# EAGLE design hwsdemu-final (EAGLE 9.0.1)

## Sheet 1 of 3
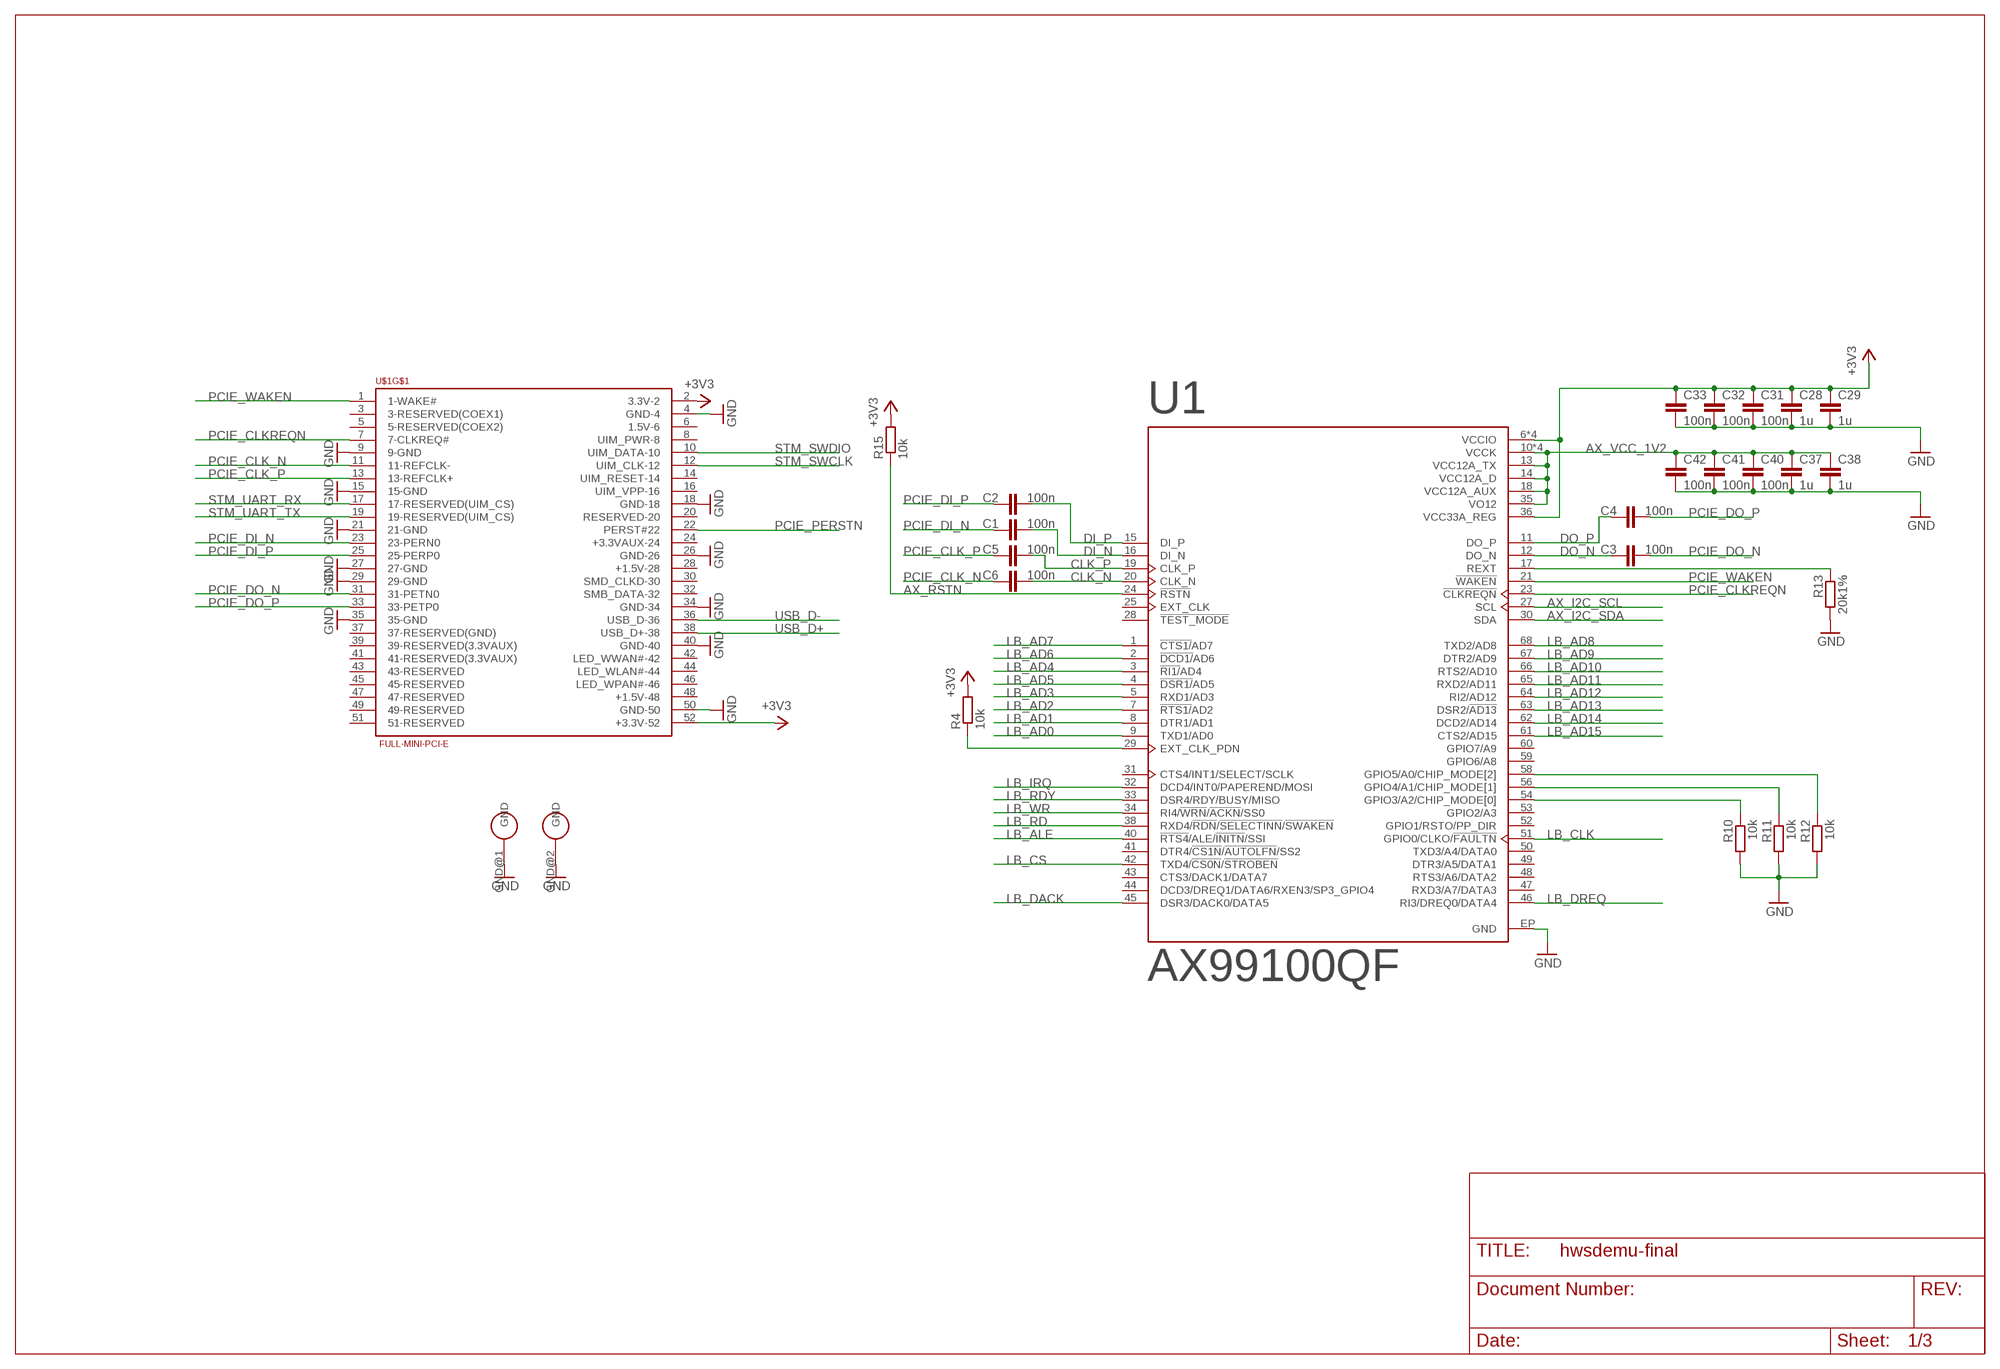
[diagram p0: schematic, sheet 1]

### Parts
C1  100n  C-EUC0402  [C0402]
C2  100n  C-EUC0402  [C0402]
C3  100n  C-EUC0402  [C0402]
C4  100n  C-EUC0402  [C0402]
C5  100n  C-EUC0402  [C0402]
C6  100n  C-EUC0402  [C0402]
C28  1u  C-EUC0402  [C0402]
C29  1u  C-EUC0402  [C0402]
C31  100n  C-EUC0402  [C0402]
C32  100n  C-EUC0402  [C0402]
C33  100n  C-EUC0402  [C0402]
C37  1u  C-EUC0402  [C0402]
C38  1u  C-EUC0402  [C0402]
C40  100n  C-EUC0402  [C0402]
C41  100n  C-EUC0402  [C0402]
C42  100n  C-EUC0402  [C0402]
R4  10k  R-EU_R0402  [R0402]
R10  10k  R-EU_R0402  [R0402]
R11  10k  R-EU_R0402  [R0402]
R12  10k  R-EU_R0402  [R0402]
R13  20k1%  R-EU_R0402  [R0402]
R15  10k  R-EU_R0402  [R0402]
U1  AX99100QF  [QFN40P800X800X90-69N]
U$1  FULL-MINI-PCI-E  [FULL-MINI-PCI-E]

### Nets
+3V3 [supply]: C28.1 C29.1 C31.1 C32.1 C33.1 R4.2 R15.2 U1.6(VCCIO) U1.26(VCCIO) U1.36(VCC33A_REG) U1.39(VCCIO) U1.55(VCCIO) U$1.2(3.3V-2) U$1.52(+3.3V-52) ; also sheet 2,3
AX_I2C_SCL: U1.27(SCL) ; also sheet 3
AX_I2C_SDA: U1.30(SDA) ; also sheet 3
AX_RSTN: R15.1 U1.24(!RSTN) ; also sheet 3
AX_VCC_1V2 [supply]: C37.1 C38.1 C40.1 C41.1 C42.1 U1.10(VCCK) U1.13(VCC12A_TX) U1.14(VCC12A_D) U1.18(VCC12A_AUX) U1.22(VCCK) U1.35(VO12) U1.37(VCCK) U1.57(VCCK)
CLK_N [differential]: C6.2 U1.20(CLK_N)
CLK_P [differential]: C5.2 U1.19(CLK_P)
DI_N [differential]: C1.2 U1.16(DI_N)
DI_P [differential]: C2.2 U1.15(DI_P)
DO_N [differential]: C3.1 U1.12(DO_N)
DO_P [differential]: C4.1 U1.11(DO_P)
GND [supply]: C28.2 C29.2 C31.2 C32.2 C33.2 C37.2 C38.2 C40.2 C41.2 C42.2 R10.2 R11.2 R12.2 R13.2 U1.EP(GND) U$1.4(GND-4) U$1.9(9-GND) U$1.15(15-GND) U$1.18(GND-18) U$1.21(21-GND) U$1.26(GND-26) U$1.27(27-GND) U$1.29(29-GND) U$1.34(GND-34) U$1.35(35-GND) U$1.40(GND-40) U$1.50(GND-50) U$1.GND@1(GND) U$1.GND@2(GND) ; also sheet 2,3
LB_AD0: U1.9(TXD1/AD0) ; also sheet 2
LB_AD1: U1.8(DTR1/AD1) ; also sheet 2
LB_AD2: U1.7(!RTS1/!AD2) ; also sheet 2
LB_AD3: U1.5(RXD1/AD3) ; also sheet 2
LB_AD4: U1.3(!RI1/!AD4) ; also sheet 2
LB_AD5: U1.4(!DSR1/!AD5) ; also sheet 2
LB_AD6: U1.2(!DCD1/!AD6) ; also sheet 2
LB_AD7: U1.1(!CTS1/!AD7) ; also sheet 2
LB_AD8: U1.68(TXD2/AD8) ; also sheet 2
LB_AD9: U1.67(DTR2/AD9) ; also sheet 2
LB_AD10: U1.66(RTS2/AD10) ; also sheet 2
LB_AD11: U1.65(RXD2/AD11) ; also sheet 2
LB_AD12: U1.64(RI2/AD12) ; also sheet 2
LB_AD13: U1.63(DSR2/!AD13) ; also sheet 2
LB_AD14: U1.62(DCD2/AD14) ; also sheet 2
LB_AD15: U1.61(CTS2/AD15) ; also sheet 2
LB_ALE: U1.40(!RTS4!/ALE/!INITN!/SSI) ; also sheet 2
LB_CLK: U1.51(GPIO0/CLKO/!FAULTN) ; also sheet 2
LB_CS: U1.42(TXD4/!CS0N!/!STROBEN) ; also sheet 2
LB_DACK: U1.45(DSR3/DACK0/DATA5) ; also sheet 2
LB_DREQ: U1.46(RI3/DREQ0/DATA4) ; also sheet 2
LB_IRQ: U1.32(DCD4/INT0/PAPEREND/MOSI) ; also sheet 2
LB_RD: U1.38(RXD4/!RDN!/!SELECTINN!/!SWAKEN) ; also sheet 2
LB_RDY: U1.33(DSR4/RDY/BUSY/MISO) ; also sheet 2
LB_WR: U1.34(RI4/!WRN!/!ACKN!/SS0) ; also sheet 2
N$1: R4.1 U1.29(EXT_CLK_PDN)
N$2: R10.1 U1.54(GPIO3/A2/CHIP_MODE[0])
N$3: R11.1 U1.56(GPIO4/A1/CHIP_MODE[1])
N$4: R12.1 U1.58(GPIO5/A0/CHIP_MODE[2])
N$7: R13.1 U1.17(REXT)
PCIE_CLK_N [differential]: C6.1 U$1.11(11-REFCLK-)
PCIE_CLK_P [differential]: C5.1 U$1.13(13-REFCLK+)
PCIE_CLKREQN: U1.23(!CLKREQN) U$1.7(7-CLKREQ#)
PCIE_DI_N [differential]: C1.1 U$1.23(23-PERN0)
PCIE_DI_P [differential]: C2.1 U$1.25(25-PERP0)
PCIE_DO_N [differential]: C3.2 U$1.31(31-PETN0)
PCIE_DO_P [differential]: C4.2 U$1.33(33-PETP0)
PCIE_PERSTN: U$1.22(PERST#22) ; also sheet 3
PCIE_WAKEN: U1.21(!WAKEN) U$1.1(1-WAKE#)
STM_SWCLK: U$1.12(UIM_CLK-12) ; also sheet 3
STM_SWDIO: U$1.10(UIM_DATA-10) ; also sheet 3
STM_UART_RX: U$1.17(17-RESERVED(UIM_CS)) ; also sheet 3
STM_UART_TX: U$1.19(19-RESERVED(UIM_CS)) ; also sheet 3
USB_D+: U$1.38(USB_D+-38) ; also sheet 3
USB_D-: U$1.36(USB_D-36) ; also sheet 3
Unconnected: U1.25(EXT_CLK) U1.28(!TEST_MODE) U1.31(CTS4/INT1/SELECT/SCLK) U1.41(DTR4/!CS1N!/!AUTOLFN!/SS2) U1.43(CTS3/DACK1/DATA7) U1.44(DCD3/DREQ1/DATA6/RXEN3/SP3_GPIO4) U1.47(RXD3/A7/DATA3) U1.48(RTS3/A6/DATA2) U1.49(DTR3/A5/DATA1) U1.50(TXD3/A4/DATA0) U1.52(GPIO1/RSTO/PP_DIR) U1.53(GPIO2/A3) U1.59(GPIO6/A8) U1.60(GPIO7/A9) U$1.3(3-RESERVED(COEX1)) U$1.5(5-RESERVED(COEX2)) U$1.6(1.5V-6) U$1.8(UIM_PWR-8) U$1.14(UIM_RESET-14) U$1.16(UIM_VPP-16) U$1.20(RESERVED-20) U$1.24(+3.3VAUX-24) U$1.28(+1.5V-28) U$1.30(SMD_CLKD-30) U$1.32(SMB_DATA-32) U$1.37(37-RESERVED(GND)) U$1.39(39-RESERVED(3.3VAUX)) U$1.41(41-RESERVED(3.3VAUX)) U$1.42(LED_WWAN#-42) U$1.43(43-RESERVED) U$1.44(LED_WLAN#-44) U$1.45(45-RESERVED) U$1.46(LED_WPAN#-46) U$1.47(47-RESERVED) U$1.48(+1.5V-48) U$1.49(49-RESERVED) U$1.51(51-RESERVED)

## Sheet 2 of 3
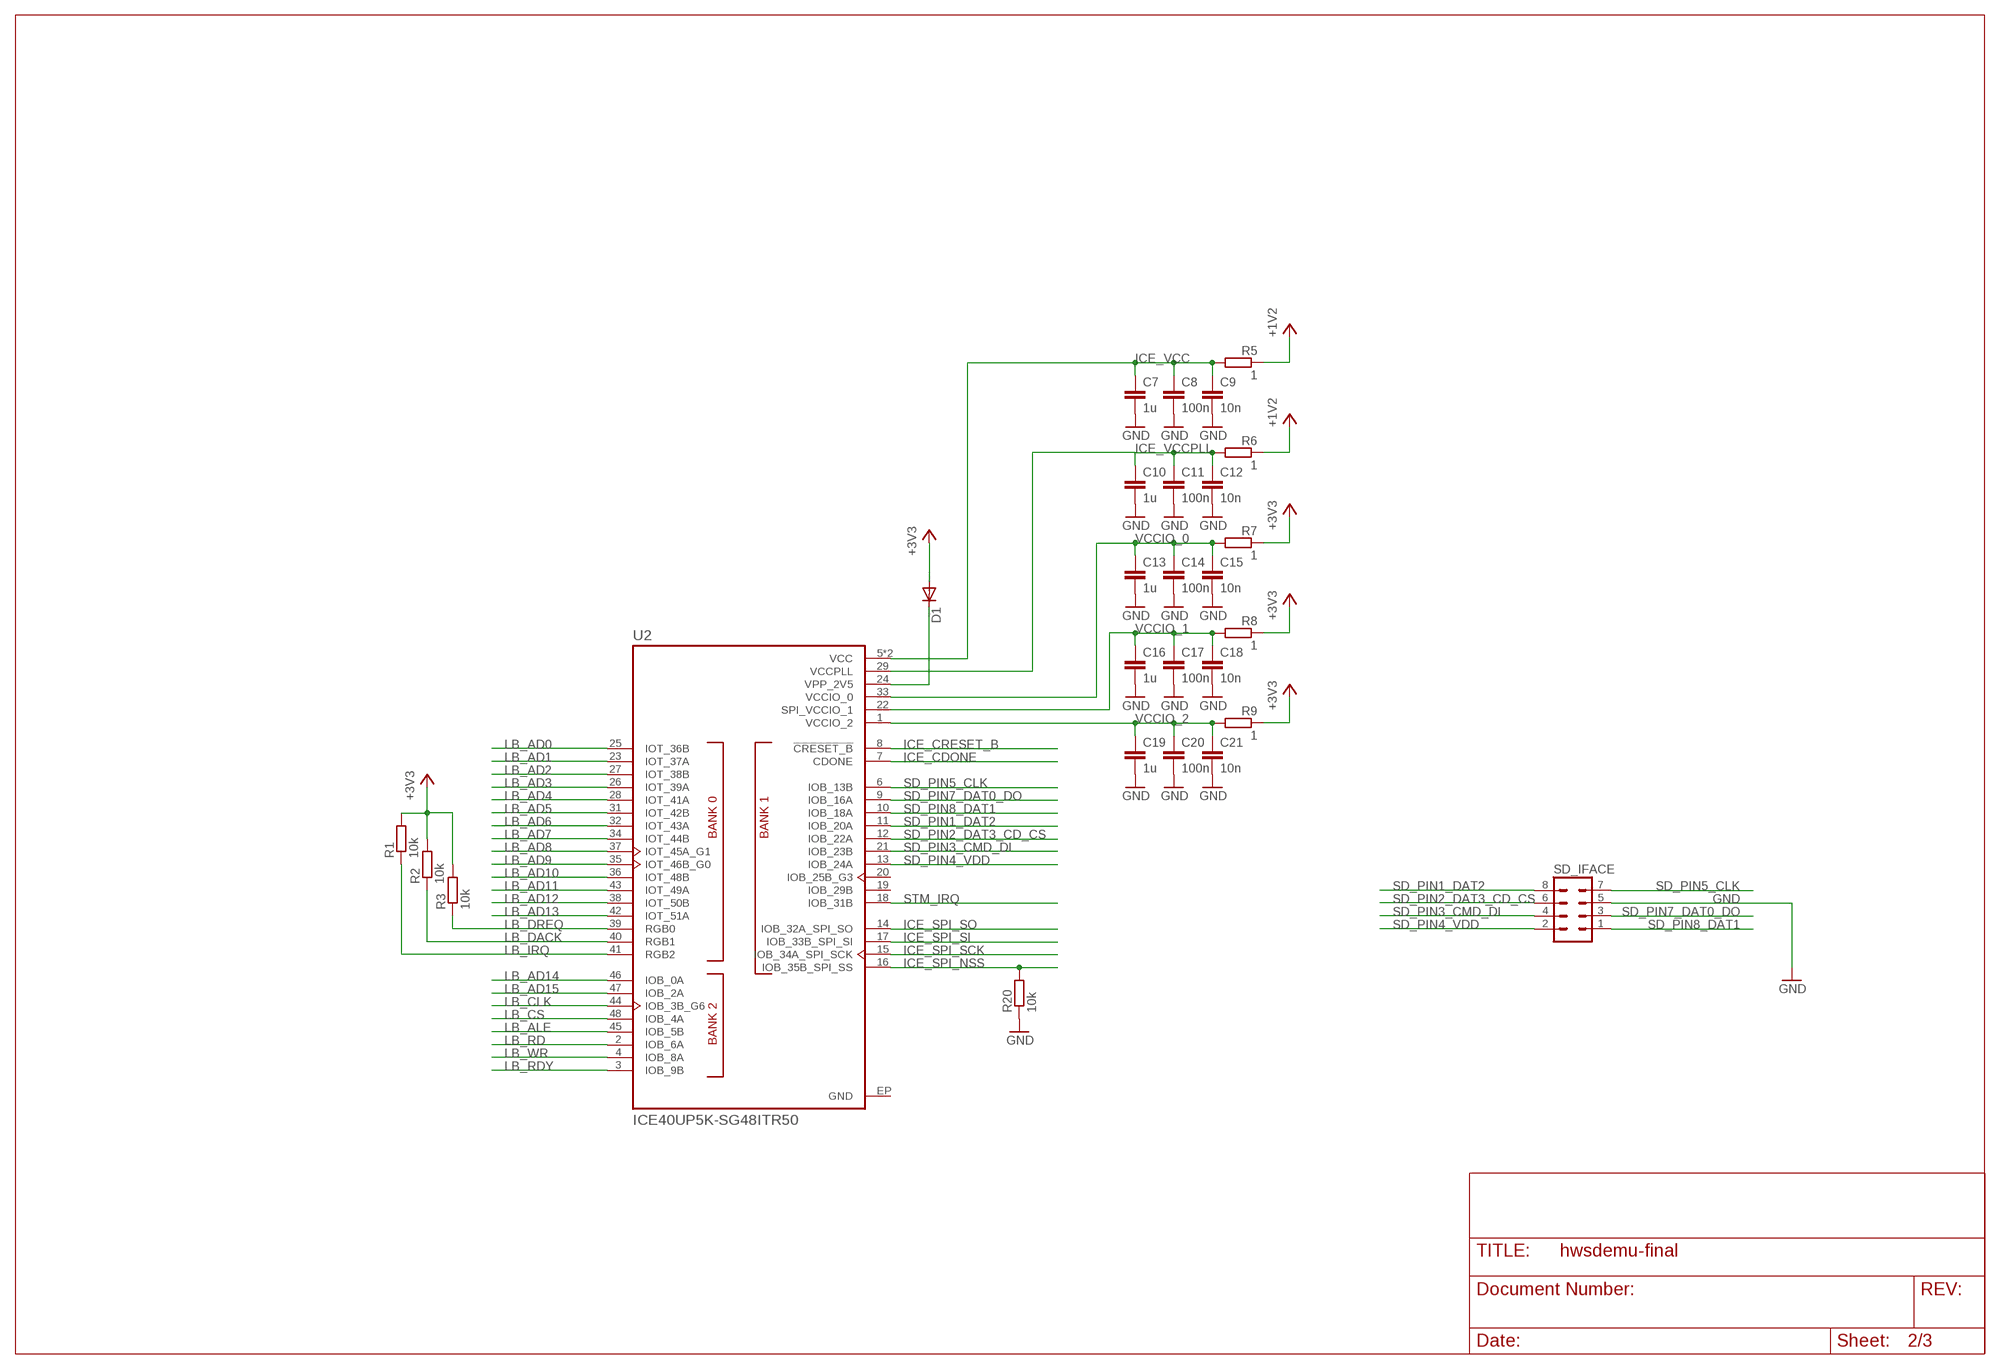
[diagram p1: schematic, sheet 2]

### Parts
C7  1u  C-EUC0402  [C0402]
C8  100n  C-EUC0402  [C0402]
C9  10n  C-EUC0402  [C0402]
C10  1u  C-EUC0402  [C0402]
C11  100n  C-EUC0402  [C0402]
C12  10n  C-EUC0402  [C0402]
C13  1u  C-EUC0402  [C0402]
C14  100n  C-EUC0402  [C0402]
C15  10n  C-EUC0402  [C0402]
C16  1u  C-EUC0402  [C0402]
C17  100n  C-EUC0402  [C0402]
C18  10n  C-EUC0402  [C0402]
C19  1u  C-EUC0402  [C0402]
C20  100n  C-EUC0402  [C0402]
C21  10n  C-EUC0402  [C0402]
D1  DIODE-MICROMELF-W  [MICROMELF-W]
R1  10k  R-EU_R0402  [R0402]
R2  10k  R-EU_R0402  [R0402]
R3  10k  R-EU_R0402  [R0402]
R5  1  R-EU_R0402  [R0402]
R6  1  R-EU_R0402  [R0402]
R7  1  R-EU_R0402  [R0402]
R8  1  R-EU_R0402  [R0402]
R9  1  R-EU_R0402  [R0402]
R20  10k  R-EU_R0402  [R0402]
SD_IFACE  MA04-2  [MA04-2]
U2  ICE40UP5K-SG48ITR50  [QFN50P700X700X100-49N]

### Nets
+1V2 [supply]: R5.1 R6.1 ; also sheet 3
+3V3 [supply]: D1.A R1.2 R2.2 R3.2 R7.1 R8.1 R9.1 ; also sheet 1,3
GND [supply]: C7.2 C8.2 C9.2 C10.2 C11.2 C12.2 C13.2 C14.2 C15.2 C16.2 C17.2 C18.2 C19.2 C20.2 C21.2 R20.1 SD_IFACE.5 ; also sheet 1,3
ICE_CDONE: U2.7(CDONE) ; also sheet 3
ICE_CRESET_B: U2.8(!CRESET_B) ; also sheet 3
ICE_SPI_NSS: R20.2 U2.16(IOB_35B_SPI_SS) ; also sheet 3
ICE_SPI_SCK: U2.15(IOB_34A_SPI_SCK) ; also sheet 3
ICE_SPI_SI: U2.17(IOB_33B_SPI_SI) ; also sheet 3
ICE_SPI_SO: U2.14(IOB_32A_SPI_SO) ; also sheet 3
ICE_VCC [supply]: C7.1 C8.1 C9.1 R5.2 U2.5(VCC) U2.30(VCC)
ICE_VCCPLL [supply]: C10.1 C11.1 C12.1 R6.2 U2.29(VCCPLL)
LB_AD0: U2.25(IOT_36B) ; also sheet 1
LB_AD1: U2.23(IOT_37A) ; also sheet 1
LB_AD2: U2.27(IOT_38B) ; also sheet 1
LB_AD3: U2.26(IOT_39A) ; also sheet 1
LB_AD4: U2.28(IOT_41A) ; also sheet 1
LB_AD5: U2.31(IOT_42B) ; also sheet 1
LB_AD6: U2.32(IOT_43A) ; also sheet 1
LB_AD7: U2.34(IOT_44B) ; also sheet 1
LB_AD8: U2.37(IOT_45A_G1) ; also sheet 1
LB_AD9: U2.35(IOT_46B_G0) ; also sheet 1
LB_AD10: U2.36(IOT_48B) ; also sheet 1
LB_AD11: U2.43(IOT_49A) ; also sheet 1
LB_AD12: U2.38(IOT_50B) ; also sheet 1
LB_AD13: U2.42(IOT_51A) ; also sheet 1
LB_AD14: U2.46(IOB_0A) ; also sheet 1
LB_AD15: U2.47(IOB_2A) ; also sheet 1
LB_ALE: U2.45(IOB_5B) ; also sheet 1
LB_CLK: U2.44(IOB_3B_G6) ; also sheet 1
LB_CS: U2.48(IOB_4A) ; also sheet 1
LB_DACK: R2.1 U2.40(RGB1) ; also sheet 1
LB_DREQ: R3.1 U2.39(RGB0) ; also sheet 1
LB_IRQ: R1.1 U2.41(RGB2) ; also sheet 1
LB_RD: U2.2(IOB_6A) ; also sheet 1
LB_RDY: U2.3(IOB_9B) ; also sheet 1
LB_WR: U2.4(IOB_8A) ; also sheet 1
N$8: D1.C U2.24(VPP_2V5)
SD_PIN1_DAT2: SD_IFACE.8 U2.11(IOB_20A)
SD_PIN2_DAT3_CD_CS: SD_IFACE.6 U2.12(IOB_22A)
SD_PIN3_CMD_DI: SD_IFACE.4 U2.21(IOB_23B)
SD_PIN4_VDD: SD_IFACE.2 U2.13(IOB_24A)
SD_PIN5_CLK: SD_IFACE.7 U2.6(IOB_13B)
SD_PIN7_DAT0_DO: SD_IFACE.3 U2.9(IOB_16A)
SD_PIN8_DAT1: SD_IFACE.1 U2.10(IOB_18A)
STM_IRQ: U2.18(IOB_31B) ; also sheet 3
VCCIO_0 [supply]: C13.1 C14.1 C15.1 R7.2 U2.33(VCCIO_0)
VCCIO_1 [supply]: C16.1 C17.1 C18.1 R8.2 U2.22(SPI_VCCIO_1)
VCCIO_2 [supply]: C19.1 C20.1 C21.1 R9.2 U2.1(VCCIO_2)
Unconnected: U2.19(IOB_29B) U2.20(IOB_25B_G3)

## Sheet 3 of 3
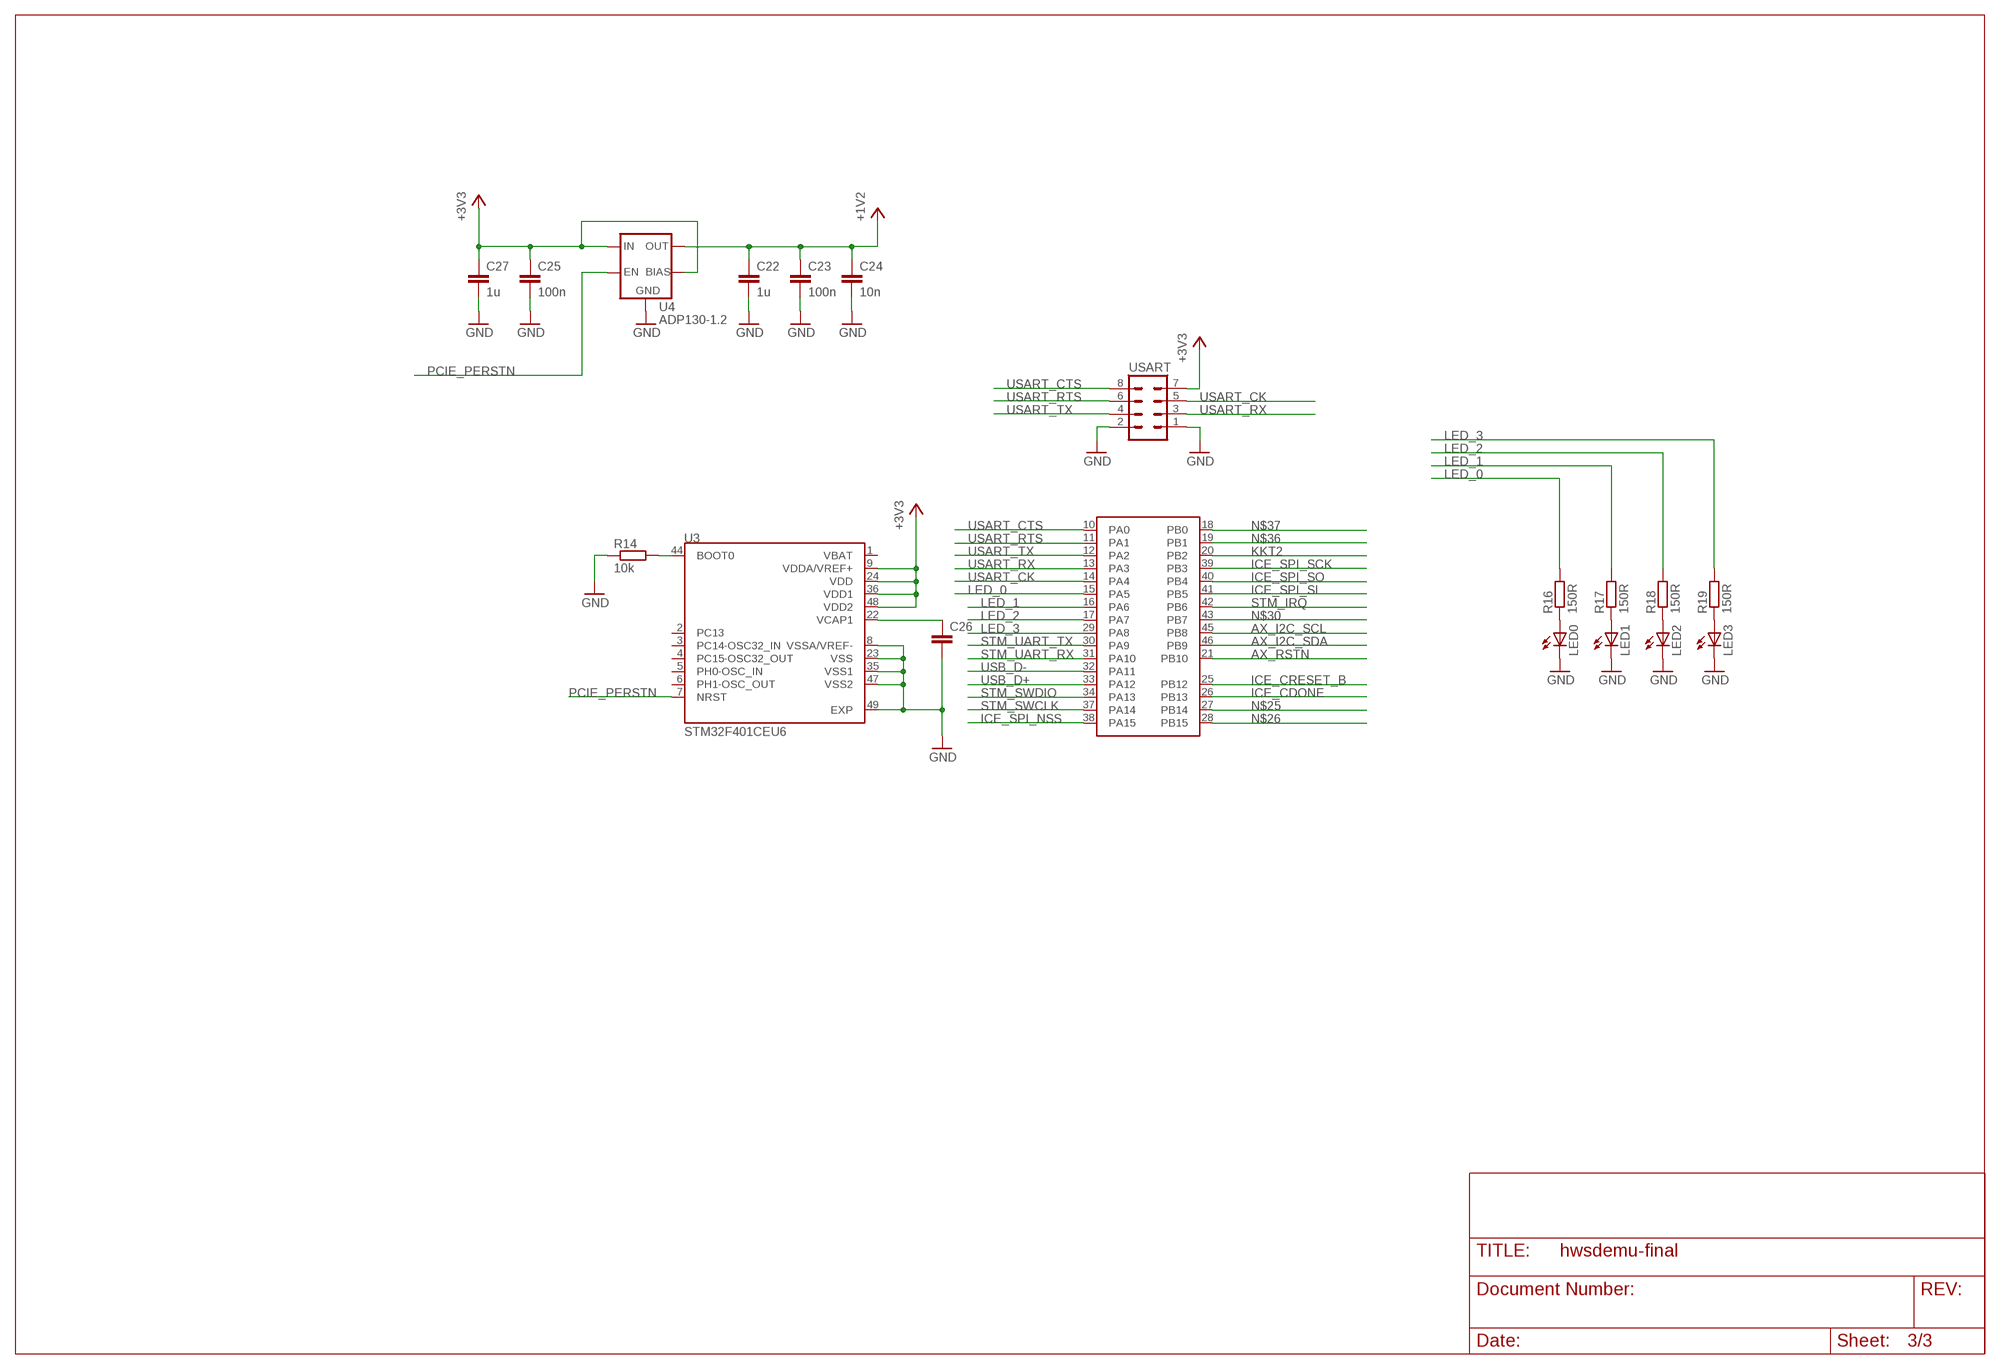
[diagram p2: schematic, sheet 3]

### Parts
C22  1u  C-EUC0402  [C0402]
C23  100n  C-EUC0402  [C0402]
C24  10n  C-EUC0402  [C0402]
C25  100n  C-EUC0402  [C0402]
C26  C-EUC0402  [C0402]
C27  1u  C-EUC0402  [C0402]
LED0  LEDCHIP-LED0603  [CHIP-LED0603]
LED1  LEDCHIP-LED0603  [CHIP-LED0603]
LED2  LEDCHIP-LED0603  [CHIP-LED0603]
LED3  LEDCHIP-LED0603  [CHIP-LED0603]
R14  10k  R-EU_R0402  [R0402]
R16  150R  R-EU_R0402  [R0402]
R17  150R  R-EU_R0402  [R0402]
R18  150R  R-EU_R0402  [R0402]
R19  150R  R-EU_R0402  [R0402]
U3  STM32F401CEU6  [QFN50P700X700X60-49N]
U4  ADP130-1.2  ADP130  [SOT23-5]
USART  MA04-2  [MA04-2]

### Nets
+1V2 [supply]: C22.1 C23.1 C24.1 U4.5(OUT) ; also sheet 2
+3V3 [supply]: C25.1 C27.1 U3.9(VDDA/VREF+) U3.24(VDD) U3.36(VDD1) U3.48(VDD2) U4.1(IN) U4.4(BIAS) USART.7 ; also sheet 1,2
AX_I2C_SCL: U3.45(PB8) ; also sheet 1
AX_I2C_SDA: U3.46(PB9) ; also sheet 1
AX_RSTN: U3.21(PB10) ; also sheet 1
GND [supply]: C22.2 C23.2 C24.2 C25.2 C26.2 C27.2 LED0.C LED1.C LED2.C LED3.C R14.1 U3.8(VSSA/VREF-) U3.23(VSS) U3.35(VSS1) U3.47(VSS2) U3.49(EXP) U4.2(GND) USART.1 USART.2 ; also sheet 1,2
ICE_CDONE: U3.26(PB13) ; also sheet 2
ICE_CRESET_B: U3.25(PB12) ; also sheet 2
ICE_SPI_NSS: U3.38(PA15) ; also sheet 2
ICE_SPI_SCK: U3.39(PB3) ; also sheet 2
ICE_SPI_SI: U3.41(PB5) ; also sheet 2
ICE_SPI_SO: U3.40(PB4) ; also sheet 2
KKT2: U3.20(PB2)
LED_0: R16.2 U3.15(PA5)
LED_1: R17.2 U3.16(PA6)
LED_2: R18.2 U3.17(PA7)
LED_3: R19.2 U3.29(PA8)
N$5: R14.2 U3.44(BOOT0)
N$6: C26.1 U3.22(VCAP1)
N$10: LED0.A R16.1
N$11: LED1.A R17.1
N$12: LED2.A R18.1
N$13: LED3.A R19.1
N$25: U3.27(PB14)
N$26: U3.28(PB15)
N$30: U3.43(PB7)
N$36: U3.19(PB1)
N$37: U3.18(PB0)
PCIE_PERSTN: U3.7(NRST) U4.3(EN) ; also sheet 1
STM_IRQ: U3.42(PB6) ; also sheet 2
STM_SWCLK: U3.37(PA14) ; also sheet 1
STM_SWDIO: U3.34(PA13) ; also sheet 1
STM_UART_RX: U3.31(PA10) ; also sheet 1
STM_UART_TX: U3.30(PA9) ; also sheet 1
USART_CK: U3.14(PA4) USART.5
USART_CTS: U3.10(PA0) USART.8
USART_RTS: U3.11(PA1) USART.6
USART_RX: U3.13(PA3) USART.3
USART_TX: U3.12(PA2) USART.4
USB_D+: U3.33(PA12) ; also sheet 1
USB_D-: U3.32(PA11) ; also sheet 1
Unconnected: U3.2(PC13) U3.3(PC14-OSC32_IN) U3.4(PC15-OSC32_OUT) U3.5(PH0-OSC_IN) U3.6(PH1-OSC_OUT)

## Power pins joined to a net without a drawn wire
GND: U2.EP(GND)
VBAT: U3.1(VBAT)

## Library data of the parts
C1-C29 C31-C33 C37 C38 C40-C42 = resistor:C-EU: CAPACITOR, European symbol
D1 = diode:DIODE-: DIODE
LED0 LED1-LED3 = led:LED: LED OSRAM: - CHIPLED LG R971, LG N971, LY N971, LG Q971, LY Q971, LO R971, LY R971 LH N974, LH R974 LS Q976, LO Q976, LY Q976 LO Q996 - Hyper CHIPLED LW Q18S LB Q993, LB Q99A, LB R99A - SideLED LS A670, LO A670, LY A670, LG A670, LP A670 LB A673, LV A673, LT A673, LW A673 LH A674 LY A675 LS A676, LA A676, LO A676, LY A676, LW A676 LS A679, LY A679, LG A679 - Hyper Micro SIDELED® LS Y876, LA Y876, LO Y876, LY Y876 LT Y87S - SmartLED LW L88C, LW L88S LB L89C, LB L89S, LG L890 LS L89K, LO L89K, LY L89K LS L896, LA L896, LO L896, LY L896 - TOPLED LS T670, LO T670, LY T670, LG T670, LP T670 LSG T670, LSP T670, LSY T670, LOP T670, LYG T670 LG T671, LOG T671, LSG T671 LB T673, LV T673, LT T673, LW T673 LH T674 LS T676, LA T676, LO T676, LY T676, LB T676, LH T676, LSB T676, LW T676 LB T67C, LV T67C, LT T67C, LS T67K, LO T67K, LY T67K, LW E67C LS E67B, LA E67B, LO E67B, LY E67B, LB E67C, LV E67C, LT E67C LW T67C LS T679, LY T679, LG T679 LS T770, LO T770, LY T770, LG T770, LP T770 LB T773, LV T773, LT T773, LW T773 LH T774 LS E675, LA E675, LY E675, LS T675 LS T776, LA T776, LO T776, LY T776, LB T776 LHGB T686 LT T68C, LB T68C - Hyper Mini TOPLED® LB M676 - Mini TOPLED Santana® LG M470 LS M47K, LO M47K, LY M47K Source: http://www.osram.convergy.de LUXEON: - LUMILED® LXK2-PW12-R00, LXK2-PW12-S00, LXK2-PW14-U00, LXK2-PW14-V00 LXK2-PM12-R00, LXK2-PM12-S00, LXK2-PM14-U00 LXK2-PE12-Q00, LXK2-PE12-R00, LXK2-PE12-S00, LXK2-PE14-T00, LXK2-PE14-U00 LXK2-PB12-K00, LXK2-PB12-L00, LXK2-PB12-M00, LXK2-PB14-N00, LXK2-PB14-P00, LXK2-PB14-Q00 LXK2-PR12-L00, LXK2-PR12-M00, LXK2-PR14-Q00, LXK2-PR14-R00 LXK2-PD12-Q00, LXK2-PD12-R00, LXK2-PD12-S00 LXK2-PH12-R00, LXK2-PH12-S00 LXK2-PL12-P00, LXK2-PL12-Q00, LXK2-PL12-R00 Source: www.luxeon.com KINGBRIGHT: KA-3528ASYC Source: www.kingbright.com
R1-R20 = resistor:R-EU_: RESISTOR, European symbol
SD_IFACE USART = con-lstb:MA04-2: PIN HEADER; OC_FARNELL: unknown; OC_NEWARK: unknown
U1 = AX99100QF:AX99100QF: Single Chip Controller; AVAILABILITY: Warning; DESCRIPTION: Single Chip Controller; MF: ASIX; MP: AX99100QF; PACKAGE: None; PRICE: 6.05 USD
U2 = ICE40UP5K-SG48ITR50:ICE40UP5K-SG48ITR50: iCE40 UltraPlus 5280 LUTs 39 I/O 1.2 V Surface Mount FOPGA - QFN-48; AVAILABILITY: Warning; DESCRIPTION: iCE40 UltraPlus 5280 LUTs 39 I/O 1.2 V Surface Mount FOPGA - QFN-48; MF: Lattice Semiconductor; MP: ICE40UP5K-SG48ITR50; PACKAGE: QFN-48 Lattice Semiconductor; PRICE: 5.45 USD
U3 = STM32F401CEU6:STM32F401CEU6: 32 Bit Microcontroller, Dynamic Efficiency Line, ARM Cortex-M4, 84 MHz, 512 KB, 96 KB, 48, UFQFPN; AVAILABILITY: Good; DESCRIPTION: 32 Bit Microcontroller, Dynamic Efficiency Line, ARM Cortex-M4, 84 MHz, 512 KB, 96 KB, 48, UFQFPN; MF: STMicroelectronics; MP: STM32F401CEU6; PACKAGE: VFQFN-48 STMicroelectronics; PRICE: 4.82 USD
U4 = adp130:ADP130
U$1 = mini-pci-e:FULL-MINI-PCI-E

## Net classes
0 default: clearance 0.203 mm
1 differential: width 0.152 mm, drill 0.356 mm, clearance 0.203 mm
2 supply: width 0.152 mm, clearance 0.203 mm

## Board
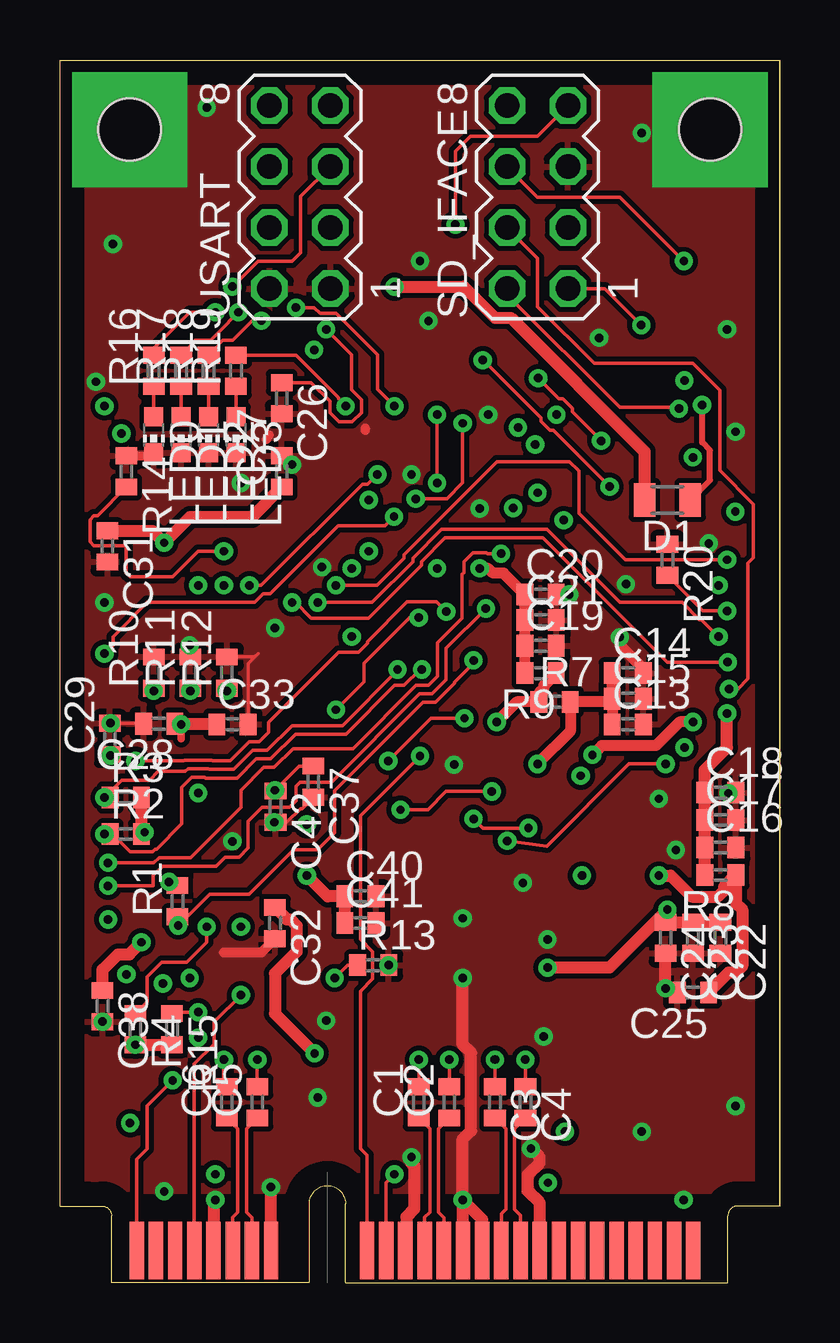
[diagram p3: board, top side]
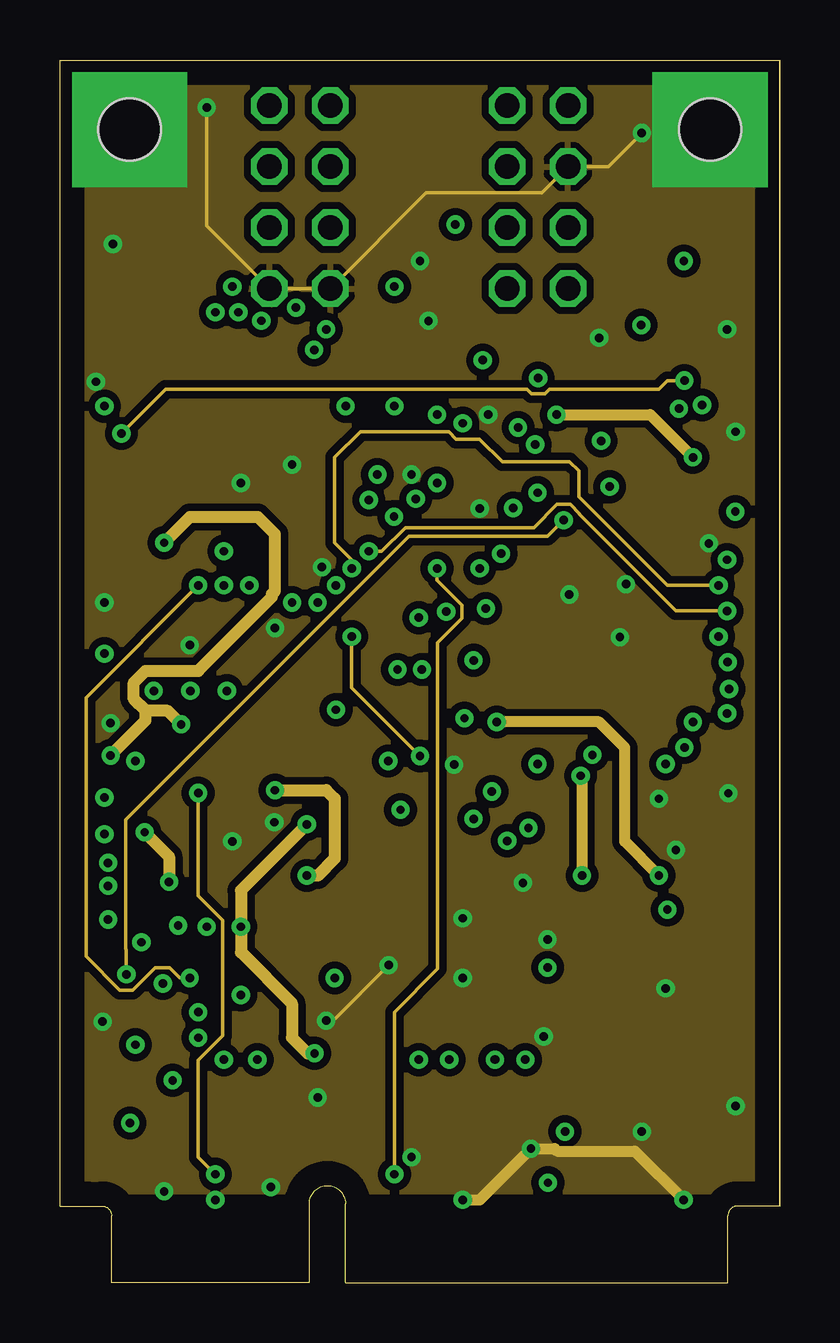
[diagram p4: board, inner layer GND]
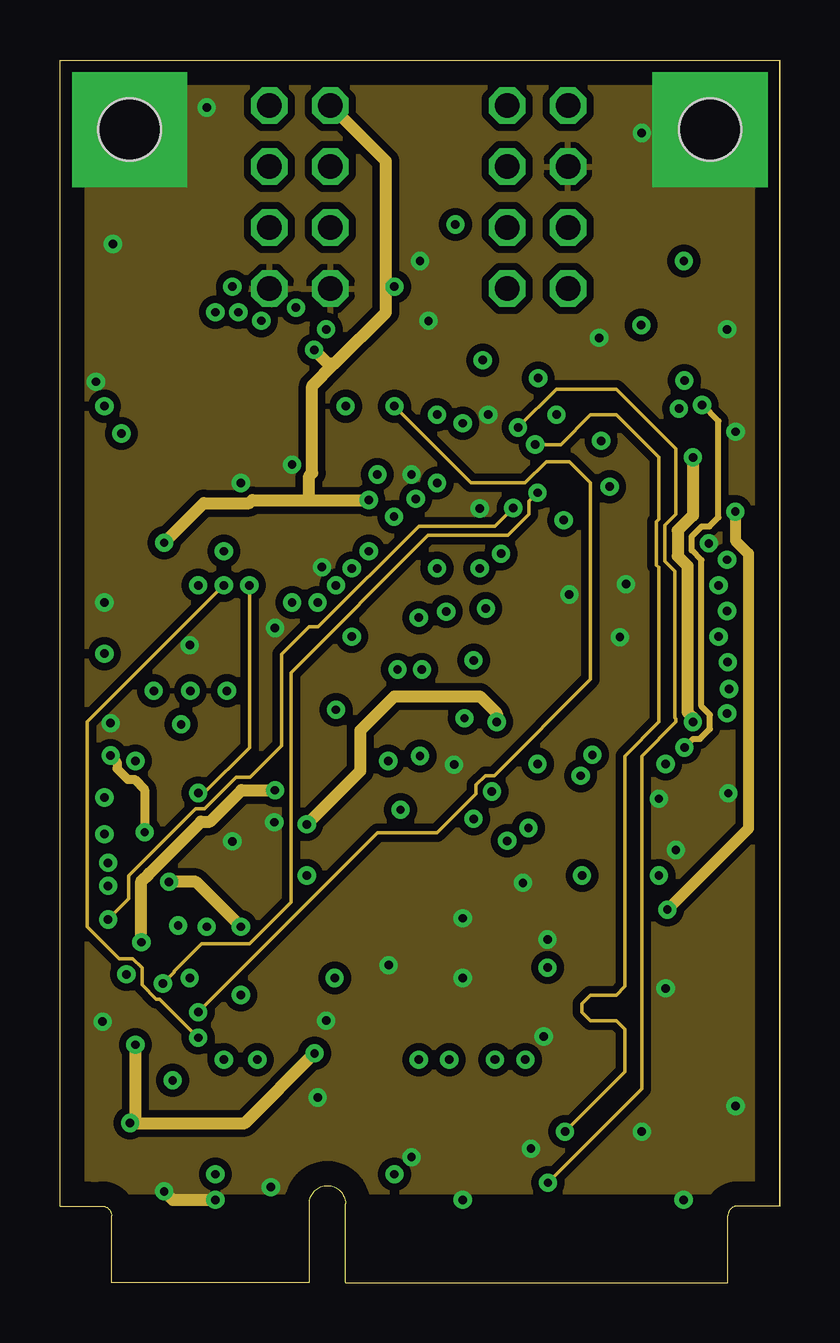
[diagram p5: board, inner layer VCC]
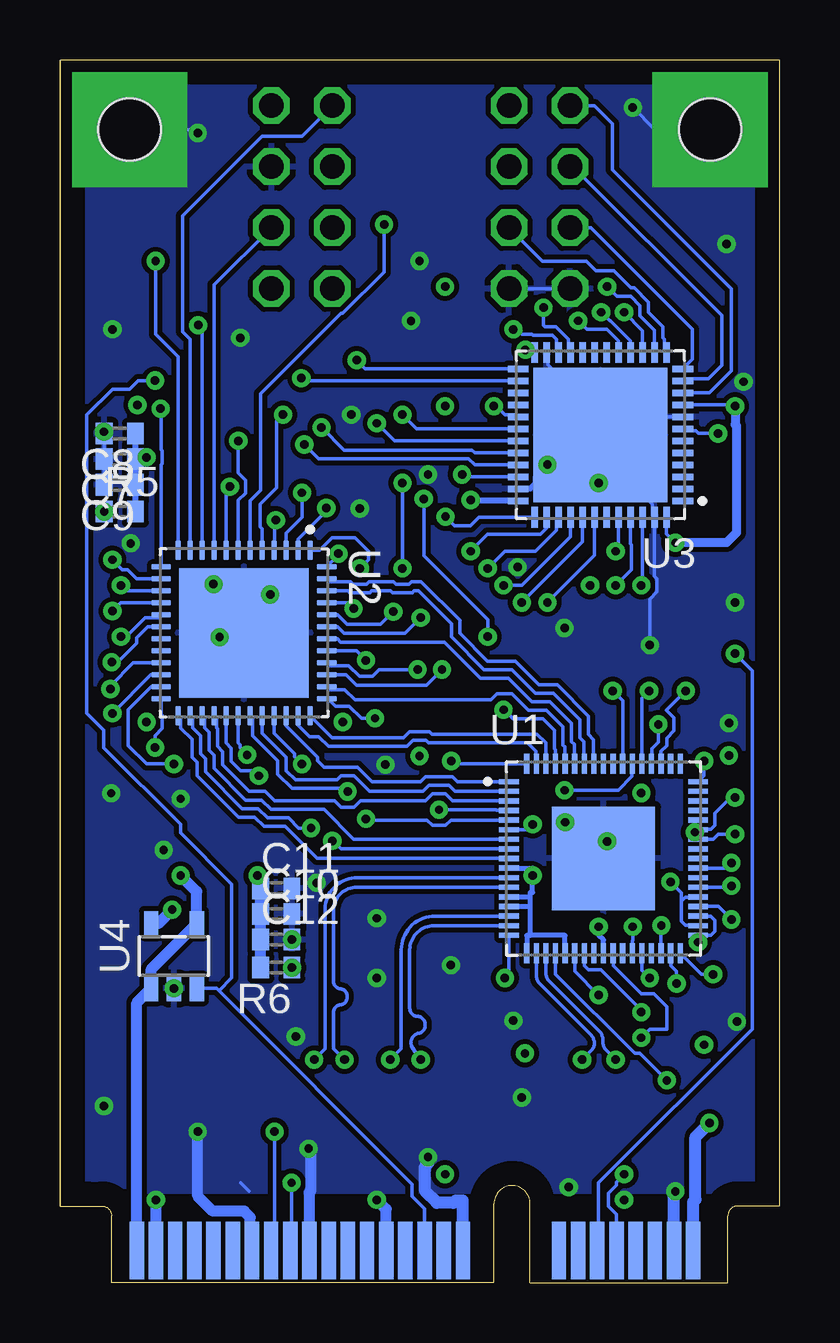
[diagram p6: board, bottom side, seen from below]

Size 30 x 50.95 mm. Coordinates in mm from the lower left corner, seen from the top.
Copper layers (1*2*3*16): Top 0.035mm / dielectric 1.5mm / GND 0.035mm / dielectric 0.15mm / VCC 0.035mm / dielectric 0.2mm / Bottom 0.035mm
Design rules "default *": minimum track width 6mil, minimum drill 0.35mm, track to track 6mil, track to pad 6mil, pad to pad 6mil, via to via 6mil, smd to smd 6mil, copper to edge 40mil, drill to drill 6mil, minimum pad ring 10mil, minimum via ring 8mil, stop-mask expansion 4mil, vias tented up to drill 0mil, thermal gap 10mil

### Footprints (pad centres in the part's own frame; a part is rotated, then mirrored left to right if it is on the bottom)
C0402 = smd 0.7 x 0.9: 1 -0.65,0; 2 0.65,0
MICROMELF-W = smd 0.9 x 1.4: A 0.95,0; C -0.95,0
CHIP-LED0603 = smd 0.8 x 0.8: A 0,-0.75; C 0,0.75
R0402 = smd 0.7 x 0.9: 1 -0.65,0; 2 0.65,0
MA04-2 = drill 1.016 octagon: 1 -3.81,-1.27; 2 -3.81,1.27; 3 -1.27,-1.27; 4 -1.27,1.27; 5 1.27,-1.27; 6 1.27,1.27; 7 3.81,-1.27; 8 3.81,1.27
QFN40P800X800X90-69N = smd 0.82 x 0.22: 1 -3.945,3.2; 2 -3.945,2.8; 3 -3.945,2.4; 4 -3.945,2; 5 -3.945,1.6; 6 -3.945,1.2; 7 -3.945,0.8; 8 -3.945,0.4; 9 -3.945,0; 10 -3.945,-0.4; 11 -3.945,-0.8; 12 -3.945,-1.2; 13 -3.945,-1.6; 14 -3.945,-2; 15 -3.945,-2.4; 16 -3.945,-2.8; 17 -3.945,-3.2; 35 3.945,-3.2; 36 3.945,-2.8; 37 3.945,-2.4; 38 3.945,-2; 39 3.945,-1.6; 40 3.945,-1.2; 41 3.945,-0.8; 42 3.945,-0.4; 43 3.945,0; 44 3.945,0.4; 45 3.945,0.8; 46 3.945,1.2; 47 3.945,1.6; 48 3.945,2; 49 3.945,2.4; 50 3.945,2.8; 51 3.945,3.2 | smd 0.22 x 0.82: 18 -3.2,-3.945; 19 -2.8,-3.945; 20 -2.4,-3.945; 21 -2,-3.945; 22 -1.6,-3.945; 23 -1.2,-3.945; 24 -0.8,-3.945; 25 -0.4,-3.945; 26 0,-3.945; 27 0.4,-3.945; 28 0.8,-3.945; 29 1.2,-3.945; 30 1.6,-3.945; 31 2,-3.945; 32 2.4,-3.945; 33 2.8,-3.945; 34 3.2,-3.945; 52 3.2,3.945; 53 2.8,3.945; 54 2.4,3.945; 55 2,3.945; 56 1.6,3.945; 57 1.2,3.945; 58 0.8,3.945; 59 0.4,3.945; 60 0,3.945; 61 -0.4,3.945; 62 -0.8,3.945; 63 -1.2,3.945; 64 -1.6,3.945; 65 -2,3.945; 66 -2.4,3.945; 67 -2.8,3.945; 68 -3.2,3.945 | smd 4.3 x 4.3: EP 0,0
QFN50P700X700X100-49N = smd 0.81 x 0.22: 1 -3.45,2.75; 2 -3.45,2.25; 3 -3.45,1.75; 4 -3.45,1.25; 5 -3.45,0.75; 6 -3.45,0.25; 7 -3.45,-0.25; 8 -3.45,-0.75; 9 -3.45,-1.25; 10 -3.45,-1.75; 11 -3.45,-2.25; 12 -3.45,-2.75; 25 3.45,-2.75; 26 3.45,-2.25; 27 3.45,-1.75; 28 3.45,-1.25; 29 3.45,-0.75; 30 3.45,-0.25; 31 3.45,0.25; 32 3.45,0.75; 33 3.45,1.25; 34 3.45,1.75; 35 3.45,2.25; 36 3.45,2.75 | smd 0.22 x 0.81: 13 -2.75,-3.45; 14 -2.25,-3.45; 15 -1.75,-3.45; 16 -1.25,-3.45; 17 -0.75,-3.45; 18 -0.25,-3.45; 19 0.25,-3.45; 20 0.75,-3.45; 21 1.25,-3.45; 22 1.75,-3.45; 23 2.25,-3.45; 24 2.75,-3.45; 37 2.75,3.45; 38 2.25,3.45; 39 1.75,3.45; 40 1.25,3.45; 41 0.75,3.45; 42 0.25,3.45; 43 -0.25,3.45; 44 -0.75,3.45; 45 -1.25,3.45; 46 -1.75,3.45; 47 -2.25,3.45; 48 -2.75,3.45 | smd 5.4 x 5.4: EP 0,0
QFN50P700X700X60-49N = smd 0.86 x 0.27: 1 -3.435,2.75; 2 -3.435,2.25; 3 -3.435,1.75; 4 -3.435,1.25; 5 -3.435,0.75; 6 -3.435,0.25; 7 -3.435,-0.25; 8 -3.435,-0.75; 9 -3.435,-1.25; 10 -3.435,-1.75; 11 -3.435,-2.25; 12 -3.435,-2.75; 25 3.435,-2.75; 26 3.435,-2.25; 27 3.435,-1.75; 28 3.435,-1.25; 29 3.435,-0.75; 30 3.435,-0.25; 31 3.435,0.25; 32 3.435,0.75; 33 3.435,1.25; 34 3.435,1.75; 35 3.435,2.25; 36 3.435,2.75 | smd 0.27 x 0.86: 13 -2.75,-3.435; 14 -2.25,-3.435; 15 -1.75,-3.435; 16 -1.25,-3.435; 17 -0.75,-3.435; 18 -0.25,-3.435; 19 0.25,-3.435; 20 0.75,-3.435; 21 1.25,-3.435; 22 1.75,-3.435; 23 2.25,-3.435; 24 2.75,-3.435; 37 2.75,3.435; 38 2.25,3.435; 39 1.75,3.435; 40 1.25,3.435; 41 0.75,3.435; 42 0.25,3.435; 43 -0.25,3.435; 44 -0.75,3.435; 45 -1.25,3.435; 46 -1.75,3.435; 47 -2.25,3.435; 48 -2.75,3.435 | smd 5.6 x 5.6: 49 0,0
SOT23-5 = smd 0.6 x 1.05: 1 -0.95,-1.35; 2 0,-1.35; 3 0.95,-1.35; 4 0.95,1.35; 5 -0.95,1.35
FULL-MINI-PCI-E = smd 0.6 x 2.4: 1 -7.95,1.45; 3 -7.15,1.45; 5 -6.35,1.45; 7 -5.55,1.45; 9 -4.75,1.45; 11 -3.95,1.45; 13 -3.15,1.45; 15 -2.35,1.45; 17 1.65,1.45; 19 2.45,1.45; 21 3.25,1.45; 23 4.05,1.45; 25 4.85,1.45; 27 5.65,1.45; 29 6.45,1.45; 31 7.25,1.45; 33 8.05,1.45; 35 8.85,1.45; 37 9.65,1.45; 39 10.45,1.45; 41 11.25,1.45; 43 12.05,1.45; 45 12.85,1.45; 47 13.65,1.45; 49 14.45,1.45; 51 15.25,1.45 | smd 0.6 x 2.4 bottom: 2 -7.55,1.45; 4 -6.75,1.45; 6 -5.95,1.45; 8 -5.15,1.45; 10 -4.35,1.45; 12 -3.55,1.45; 14 -2.75,1.45; 16 -1.95,1.45; 18 2.05,1.45; 20 2.85,1.45; 22 3.65,1.45; 24 4.45,1.45; 26 5.25,1.45; 28 6.05,1.45; 30 6.85,1.45; 32 7.65,1.45; 34 8.45,1.45; 36 9.25,1.45; 38 10.05,1.45; 40 10.85,1.45; 42 11.65,1.45; 44 12.45,1.45; 46 13.25,1.45; 48 14.05,1.45; 50 14.85,1.45; 52 15.65,1.45 | drill 2.6 pad 4.8 square: GND@1 -8.25,48.15; GND@2 15.95,48.15 | hole 2.6: -8.25,48.15; 15.95,48.15

### Placement (x,y rotation side)
C1  14.96,7.52 90 top
C2  16.23,7.52 90 top
C3  18.13,7.52 270 top
C4  19.41,7.52 270 top
C5  8.23,7.52 90 top
C6  6.96,7.52 90 top
C7  27.51,34.32 180 bottom
C8  27.51,35.38 180 bottom
C9  27.51,33.25 180 bottom
C10  20.98,15.37 0 bottom
C11  20.98,16.44 0 bottom
C12  20.98,14.3 0 bottom
C13  23.67,23.27 0 top
C14  23.67,25.4 0 top
C15  23.67,24.33 0 top
C16  27.53,18.14 0 top
C17  27.53,19.28 0 top
C18  27.53,20.42 0 top
C19  20.04,26.54 0 top
C20  20.04,28.68 0 top
C21  20.04,27.61 0 top
C22  27.53,14.38 270 top
C23  26.39,14.38 270 top
C24  25.25,14.38 270 top
C25  26.39,12.09 180 top
C26  9.25,36.86 270 top
C27  9.25,33.81 90 top
C28  4.14,23.29 180 top
C29  2.08,22.66 90 top
C31  1.98,30.68 270 top
C32  8.97,14.99 270 top
C33  7.19,23.27 0 top
C37  10.57,20.88 270 top
C38  1.78,11.53 270 top
C40  12.52,16.11 0 top
C41  12.52,14.99 0 top
C42  8.99,19.84 270 top
D1  25.32,32.62 180 top
LED0  3.91,35.33 180 top
LED1  5.05,35.33 180 top
LED2  6.2,35.33 180 top
LED3  7.34,35.33 180 top
R1  4.9,15.9 90 top
R2  2.74,18.7 0 top
R3  2.74,20.22 0 top
R4  3.15,10.57 270 top
R5  27.51,32.13 0 bottom
R6  20.98,13.13 180 bottom
R7  20.62,24.21 0 top
R8  27.53,16.99 180 top
R9  20.04,25.4 180 top
R10  3.91,25.43 90 top
R11  5.44,25.43 90 top
R12  6.96,25.43 90 top
R13  13.06,13.24 0 top
R14  2.77,33.81 270 top
R15  4.67,10.57 270 top
R16  3.91,38 90 top
R17  5.05,38 90 top
R18  6.2,38 90 top
R19  7.34,38 90 top
R20  25.32,30.13 270 top
SD_IFACE  19.91,45.24 90 top
U1  7.34,17.68 0 bottom
U2  22.33,27.08 270 bottom
U3  7.47,35.33 180 bottom
U4  25.25,13.62 0 bottom
U$1  11.15,-0.1 0 top
USART  10.01,45.24 90 top

### Tracks (layer width: path | path; a pad name or v marks a point on that pad's centre or on a via)
+1V2  (via drill 0.35)
  Top 0.508: R6.1 22.91,13.13 v25.32,15.55 25.32,15.1 C24.1 C23.1 C22.1
  VCC 0.457: R5.1 28.16,30.93 28.7,30.38 28.7,18.93 v25.32,15.55
  Bottom 0.457: U4.5 25.9,14.97 v25.32,15.55
  other vias: 20.33,13.13 28.16,32.13
+3V3  (via drill 0.35)
  Top 0.305: 5.05,22.66 v5.05,23.27 | C28.1 5.05,23.29 | R1.2 4.7,16.55 v4.55,16.7
  Top 0.381: R2.2 3.45,18.7 v3.53,18.77 | C28.1 4.96,23.24 v5.05,23.27 | C29.1 2.1,22.12 v2.11,21.97
  Top 0.457: R9.1 20.17,24.88 20.17,24.77 19.97,24.57 R7.1 19.05,24.21 v18.21,23.37
  Top 0.508: R3.2 R2.2 | 2.31,22.01 C29.1 | C33.1 6.51,23.29 5.05,23.29 | v10.62,9.56 8.97,11.21 8.97,12.89 9.87,13.8 9.87,14.88 9.61,15.14 9.46,15.14 C32.1 | R4.2 R15.2 | v24.97,16.97 25.46,16.97 26.34,16.09 27.42,16.09 27.69,16.35 27.69,16.5 R8.1 28.18,15.83 28.44,15.57 28.44,13.19 28.17,12.92 27.87,12.92 C25.1 | C27.1 7.99,31.9 5.41,31.9 v4.34,30.84 3.85,31.33 C31.1 | v13.94,41.5 16.84,41.5 18.14,40.21 18.8,40.21 24.37,34.63 D1.A
  GND 0.457: v24.97,16.97 23.55,18.39 23.55,22.3 22.48,23.37 v18.21,23.37
  GND 0.508: v10.29,19.1 7.54,16.35 v7.54,14.84 7.54,13.77 9.68,11.63 9.68,10.21 10.33,9.56 v10.62,9.56 | v3.53,18.77 4.55,17.76 v4.55,16.7 | v4.34,30.84 5.41,31.9 8.25,31.9 8.97,31.19 8.97,28.82 8.84,28.69 8.84,28.58 5.76,25.5 3.57,25.5 3.08,25.01 3.08,24.32 3.57,23.83 | v5.05,23.27 4.49,23.83 3.57,23.83 | v2.11,21.97 3.57,23.43 3.57,23.83
  VCC 0.381: v3.53,18.77 3.53,20.55 3.11,20.97 2.83,20.97 2.38,21.42 2.38,21.7 v2.11,21.97
  VCC 0.508: 10.39,32.62 8.01,32.62 7.89,32.49 6,32.49 v4.34,30.84 | 10.39,32.62 v12.88,32.62 | R4.2 3.15,6.89 v2.92,6.66 7.71,6.66 v10.62,9.56 | v10.29,19.1 12.52,21.33 12.52,23.01 13.94,24.44 17.5,24.44 18.21,23.72 v18.21,23.37 | v10.6,38.87 11.17,38.3 11.46,38.3 | 11.46,38.3 13.59,40.44 13.59,41.5 | USART.7 13.59,46.74 13.59,41.5 | 10.39,32.62 10.39,33.62 10.51,33.74 10.51,37.36 11.46,38.3 | 13.59,41.5 v13.94,41.5 | v7.54,14.84 5.67,16.7 v4.55,16.7
  Bottom 0.152: 4.08,15.91 3.92,16.07 U1.39 | 4.08,15.91 4.08,15.05 3.92,14.89 U1.36 | 4.08,15.91 4.08,16.24 v4.55,16.7 | U3.24 10.32,38.87 v10.6,38.87 | U1.6 10.52,18.88 v10.29,19.1 | U1.55 5.33,22.25 5.05,22.53 v5.05,23.27 | U3.9 1.91,36.58 v1.85,36.53 | U3.48 4.72,31.21 v4.34,30.84
  Bottom 0.203: v7.54,14.84 7.54,14.49 7.34,14.29 U1.26
  Bottom 0.254: U3.36 12.85,32.58 v12.88,32.62
  Bottom 0.381: v1.85,36.53 1.85,35.77 1.79,35.71 1.79,31.25 2.21,30.84 v4.34,30.84
  Bottom 0.457: U$1.52 26.8,11.66 U4.1 26.2,13.07 U4.4 24.3,16.3 v24.97,16.97
  Bottom 0.508: U$1.2 3.6,3.37 3.51,3.47 3.51,6.07 v2.92,6.66
  other vias: 3.15,9.92
AX_I2C_SCL  (via drill 0.35)
  VCC 0.152: v5.77,10.21 4.16,11.81 4.02,11.81 3.43,12.41 3.43,13.13 3.04,13.51 2.47,13.51 1.14,14.84 1.14,23.37 v6.83,29.06
  Bottom 0.152: U1.27 6.93,13.72 6.93,13.21 5.76,12.04 5.25,12.04 4.7,11.49 4.7,10.57 5.41,10.57 v5.77,10.21 | U3.45 6.22,30.8 6.17,30.75 6.17,29.72 v6.83,29.06
AX_I2C_SDA  (via drill 0.35)
  GND 0.152: v5.41,12.7 4.99,12.7 4.56,13.13 3.98,13.13 3.04,12.2 2.5,12.2 1.09,13.6 1.09,24.39 v5.77,29.06
  Bottom 0.152: U1.30 5.74,13.03 v5.41,12.7 | v5.77,29.06 5.72,29.11 U3.46
AX_RSTN  (via drill 0.35)
  Top 0.152: R15.1 4.73,11.28 v5.77,11.28 | v13.94,36.53 13.23,37.24 13.23,38.66 11.51,40.39 10.85,40.39 10.6,40.63 v9.84,40.63
  VCC 0.152: v5.77,11.28 13.23,18.75 15.72,18.75 17.35,20.38 17.35,20.75 17.74,21.13 18.11,21.13 22.12,25.15 22.12,33.34 21.25,34.21 20.28,34.21 19.39,33.33 17.14,33.33 v13.94,36.53
  Bottom 0.152: v5.77,11.28 5.77,11.36 7.45,13.05 7.97,13.05 8.13,13.21 8.13,13.72 U1.24 | v9.84,40.63 9.84,39.89 9.78,39.83 9.32,39.83 8.8,39.32 8.8,38.85 U3.21
AX_VCC_1V2  (via drill 0.35)
  Top 0.152: C37.1 9.97,21.53 v8.97,20.52 9.09,20.54 C42.1
  Top 0.508: C41.1 C40.1 11.16,16.1 v10.29,16.97 | v3.4,14.19 2.9,13.69 2.42,13.69 1.78,13.04 C38.1
  GND 0.508: v8.97,20.52 11.1,20.52 11.46,20.17 11.46,17.68 10.74,16.97 v10.29,16.97
  VCC 0.508: v3.4,14.19 3.4,16.73 3.71,17.05 5.88,19.22 6.26,19.22 7.56,20.52 v8.97,20.52
  Bottom 0.152: U1.57 6.15,21.61 6.15,21.1 6.73,20.52 v8.97,20.52 | U1.37 3.38,15.27 2.87,15.27 2.71,15.11 2.71,14.65 2.87,14.49 2.91,14.49 2.92,14.48 U1.35 | U1.35 | U1.35 v3.4,14.19
  Bottom 0.203: U1.13 10.39,16.08 | 10.39,16.08 10.39,16.26 10.29,16.26 v10.29,16.97 10.29,17.28 U1.10 | U1.14 10.39,15.68 | 10.39,15.68 10.39,16.08 | U1.18 10.54,14.48 10.39,14.48 | U1.22 8.94,14.48 10.39,14.48 | 10.39,14.48 10.39,15.68
CLK_N  (via drill 0.36)
  Top 0.152: v6.83,9.3 6.83,8.3 C6.2
  Bottom 0.152: 6.86,9.32 arc-90 v6.83,9.3 7.22,9.68 arc45 7.37,10.04 7.37,10.13 arc-45 7.51,10.49 9.59,12.56 arc45 9.74,12.92 U1.20
CLK_P  (via drill 0.36)
  Top 0.152: v8.23,9.3 C5.2
  Bottom 0.152: U1.19 arc-90 U1.19 10.14,12.82 arc-45 9.99,12.46 7.87,10.34 arc45 7.72,9.98 arc45 7.84,9.68 v8.23,9.3
DI_N  (via drill 0.36)
  Top 0.152: v14.96,9.3 C1.2 14.96,8.16
  Bottom 0.152: U1.16 14.41,14.88 arc-90 15.42,13.87 15.42,11.43 arc-90 15.09,11.1 arc90 14.78,10.77 14.78,10.72 arc90 15.09,10.39 arc-90 15.34,9.86 15.11,9.5 v14.96,9.3
DI_P  (via drill 0.36)
  Top 0.152: v16.23,9.3 C2.2 16.23,8.16
  Bottom 0.152: U1.15 14.36,15.28 arc-90 15.77,13.87 15.77,9.76 v16.23,9.3
DO_N  (via drill 0.36)
  Top 0.152: C3.1 v18.13,9.3
  Bottom 0.152: v18.13,9.3 18.59,9.76 18.59,11.28 arc90 18.29,11.58 arc-90 18.03,11.94 arc-90 18.29,12.24 arc90 18.59,12.58 18.59,15.52 arc90 17.63,16.48 U1.12
DO_P  (via drill 0.36)
  Top 0.152: C4.1 v19.41,9.3
  Bottom 0.152: v19.41,9.3 18.95,9.76 18.95,15.57 arc90 17.59,16.88 U1.11
GND  (via drill 0.35)
  Top 0.152: 9.61,34.09 v9.68,34.09 | C37.2 10.1,19.76 10.02,19.76 9.45,19.19 C42.2 v8.94,19.19 | R12.2 8.12,26.08 | 8.12,26.08 8.25,26.21 | 8.12,26.08 7.84,25.8 C33.2 | C28.2 3.48,23.31 C29.2 | 1.98,28.12 1.98,28.22 v1.85,28.35
  Top 0.381: R14.1 3.79,34.46 LED0.C | C42.2 9.09,19.27 v8.94,19.19 | 12.74,35.62 12.72,35.51 | 8.61,35.14 8.73,35.32
  Top 0.406: 6.83,13.77 8.4,13.77 C32.2
  Top 0.457: C14.2 24.32,25.59 23.37,26.54 v23.34,26.9
  Top 0.508: U$1.15 8.8,3.98 v8.79,3.99 | U$1.9 6.4,3.38 v6.48,3.46 | U$1.21 14.44,1.39 14.44,2.74 14.78,3.08 14.78,4.87 14.66,4.99 v14.66,5.23 | U$1.27 16.8,3.44 | 16.8,3.44 v16.79,3.46 16.79,5.98 17.14,6.33 17.14,9.58 16.79,9.93 v16.79,12.7 | U$1.29 17.6,2.65 16.8,3.44 | v19.63,5.59 20,5.22 20,5 19.51,4.51 19.51,3.82 20,3.33 U$1.35 | U4.2 C24.2
  GND 0.152: v6.12,48.97 6.12,44.05 USART.2 USART.1 15.27,45.42 20.09,45.42 SD_IFACE.5 22.86,46.51 v24.26,47.91 | v13.71,13.24 11.39,10.92 v11.1,10.92
  GND 0.457: v16.79,3.46 17.5,3.46 v19.63,5.59 20.62,5.59 20.72,5.49 23.97,5.49 v26,3.46
  VCC 0.508: v4.34,3.81 4.7,3.46 v6.48,3.46
  Bottom 0.152: USART.2 USART.1 | 7.54,34.75 v7.54,33.33 6.19,33.33 5.3,32.44 5.3,31.98 U3.47 5.22,29.44 5.11,29.33 5.11,28.79 5.41,28.48 v5.41,26.57 | 7.54,34.75 7.54,35.26 | 7.54,35.26 U3.49 7.34,35.46 6.83,35.46 | U3.8 6.21,36.08 6.83,35.46 | 6.83,35.46 7.54,34.75 | 7.54,35.26 7.54,36.59 9.01,38.06 9.47,38.06 9.66,38.25 9.66,38.71 U3.23 | C8.2 C7.2 C9.2 | U$1.GND@1 5.2,48.05 v6.12,48.97 | U$1.GND@2 24.4,48.05 v24.26,47.91 | 22.48,4.17 22.12,3.81
  Bottom 0.203: v9.68,34.09 10.17,33.6 10.17,33.32 10.41,33.08 U3.35
  Bottom 0.457: U2.EP 22.5,26.9 v23.34,26.9 | U$1.26 16.4,3.07 v16.79,3.46 | U$1.34 19.6,3.77 19.54,3.83 19.54,5.49 v19.63,5.59 | v24.26,6.3 24.26,3.61 23.63,2.98 22.32,2.98 22.07,2.73 22.07,1.42 U$1.40 | U$1.50 v26,3.46
  Bottom 0.508: U$1.4 4.4,3.75 v4.34,3.81 | U1.EP 7.19,17.68 v7.19,18.39 | U$1.18 13.2,3.42 13.51,3.42 13.6,3.33 14.29,3.33 14.78,3.82 14.78,4.87 14.66,4.99 v14.66,5.23
  other vias: 21.23,28.68 20.33,14.3 25.25,12.27 1.78,10.88 28.17,35.46 27.81,39.73 15.37,40.08 2.21,43.28 1.5,37.54 15.01,42.57 8.97,27.28 17.5,32.26 17.86,36.17 16.79,15.19 10.74,7.72 28.17,7.37 22.48,39.37 16.43,21.59 24.97,20.17 27.05,30.81 23.6,29.11 14.66,33.68 25.68,18.04 2.11,23.32 19.3,16.66 27.86,20.4 10.92,29.82 20.17,10.26
  pour Bottom (isolate 0.203): 0.43,50.4 29.23,50.4 29.23,3.81 0.43,3.81
  pour Top (isolate 0.203): 0.79,50.4 0.79,3.81 29.23,3.81 29.23,50.4
  pour GND (isolate 0.305): 0.79,50.4 0.79,3.81 29.59,3.81 29.59,50.4
  pour VCC (isolate 0.305): 0.79,50.4 0.79,3.81 29.59,3.81 29.59,50.4
ICE_CDONE  (via drill 0.35)
  Top 0.152: v19.94,37.7 20.8,36.83 20.97,36.83 21.36,36.44 21.36,36.28 v22.56,35.08
  Bottom 0.152: U2.7 22.56,30.54 22.56,32.6 22.26,32.9 22.26,33.45 22.56,33.75 v22.56,35.08 | 10.99,37.5 U3.26 19.83,37.58 v19.94,37.7
ICE_CRESET_B  (via drill 0.35)
  Top 0.152: v17.63,38.44 17.65,38.44 20.04,36.05 20.04,35.9 20.43,35.51 20.58,35.51 v22.92,33.17
  Bottom 0.152: U2.8 23.08,33.02 v22.92,33.17 | 10.99,38 U3.25 17.28,38.08 v17.63,38.44
ICE_SPI_NSS  (via drill 0.35)
  Top 0.152: R20.2 26.81,27.99 v27.81,27.99
  GND 0.152: v12.88,30.48 13.42,30.48 14.4,31.46 19.76,31.46 20.73,32.43 21.27,32.43 21.66,32.05 21.66,32.01 25.68,27.99 v27.81,27.99
  Bottom 0.152: U2.16 27.48,28.33 v27.81,27.99 | U3.38 9.72,31.44 9.97,31.19 12.17,31.19 v12.88,30.48
ICE_SPI_SCK  (via drill 0.35)
  GND 0.152: v12.17,29.77 12.17,30.13 11.46,30.84 11.46,34.39 12.52,35.46 16.21,35.46 16.52,35.16 17.49,35.16 18.44,34.21 21.25,34.21 21.63,33.83 21.63,32.75 25.32,29.06 v27.46,29.06
  Bottom 0.152: U2.15 27.23,28.83 v27.46,29.06 | U3.39 9.3,31.81 9.3,31.35 10.17,30.48 11.46,30.48 v12.17,29.77
ICE_SPI_SI  (via drill 0.35)
  Top 0.152: v10.74,28.35 13.02,28.35 14.71,30.04 14.71,30.19 15.91,31.39 20.29,31.39 23.34,28.35 25.95,28.35 26.66,27.64 26.75,27.64 v27.46,26.93
  Bottom 0.152: U2.17 25.89,27.72 26.46,27.72 27.25,26.93 v27.46,26.93 | U3.41 8.22,30.88 v10.74,28.35
ICE_SPI_SO  (via drill 0.35)
  Top 0.152: v11.51,29.06 13.23,29.06 14.35,30.18 14.35,30.34 18.23,34.21 21.25,34.21 21.63,33.83 21.63,32.07 23.58,30.13 v27.81,30.13
  Bottom 0.152: v27.81,30.13 27.4,29.72 27.18,29.72 26.8,29.33 U2.14 | U3.40 8.72,31.09 10.74,29.06 v11.51,29.06
ICE_VCC  (via drill 0.35)
  Top 0.457: v22.2,22 22.59,22.39 24.85,22.39 25.83,23.37 v26.39,23.37
  GND 0.457: v26.39,34.39 24.61,36.17 v20.7,36.17
  VCC 0.508: v26.39,23.37 26.39,23.54 26.16,23.77 26.16,29.87 25.76,30.28 25.76,31.35 26.39,31.98 v26.39,34.39
  Bottom 0.152: U2.30 22.58,22.5 22.5,22.42 22.5,22.3 v22.2,22 | U2.5 21.58,31.42 21.66,31.5 21.66,32.45 20.97,33.13 20.97,35.9 v20.7,36.17
  Bottom 0.254: C7.1 26.47,34.32 v26.39,34.39 | C8.1 C7.1 | C7.1 C9.1 R5.2
ICE_VCCPLL  (via drill 0.35)
  GND 0.457: v21.71,21.13 21.77,21.07 v21.77,16.97
  Bottom 0.152: U2.29 23.08,22.49 22.86,22.27 22.86,21.73 22.47,21.34 21.92,21.34 v21.71,21.13
  Bottom 0.457: R6.2 C12.1 C10.1 C11.1 21.77,16.57 v21.77,16.97
LB_AD0
  Bottom 0.152: U2.25 24.97,23.52 24.97,23.11 24.5,22.65 24.5,21.9 24.28,21.68 24.28,21.14 22.55,19.4 21.88,19.4 21.49,19.01 21.06,19.01 20.89,19.01 20.61,19.01 19.28,17.68 U1.9
LB_AD1  (via drill 0.35)
  Top 0.152: v18.64,18.42 20.29,18.19 23.72,21.62 v25.25,21.62
  Bottom 0.152: U1.8 18.28,18.08 v18.64,18.42 | v25.25,21.62 26.39,21.62 27.15,22.38 27.15,23.88 26.21,24.83 U2.23
LB_AD2
  Bottom 0.152: U2.27 23.97,23.52 23.97,23.12 23.79,22.94 23.79,22.2 23.57,21.98 23.57,21.43 22.25,20.12 21.59,20.12 21.2,19.72 18.99,19.72 17.75,18.48 U1.7
LB_AD3  (via drill 0.35)
  Top 0.152: v17.25,19.33 17.63,18.95 v19.53,18.95
  Bottom 0.152: U2.26 24.47,23.52 24.47,23.12 24.14,22.79 24.14,22.05 23.92,21.83 23.92,21.28 22.4,19.76 21.73,19.76 21.34,19.37 20.46,19.37 20.05,18.95 v19.53,18.95 | v17.25,19.33 17.2,19.28 14.7,19.28 14.47,19.05 13.93,19.05 13.7,19.28 U1.5
LB_AD4
  Bottom 0.152: U2.28 23.47,23.52 23.47,23.12 23.43,23.09 23.43,22.35 23.21,22.13 23.21,21.58 22.11,20.47 21.44,20.47 21.05,20.08 18.54,20.08 18.28,19.82 17.74,19.82 17.47,20.08 14.76,20.08 14.47,20.37 13.93,20.37 13.64,20.08 U1.3
LB_AD5  (via drill 0.35)
  Top 0.152: v14.2,19.71 15.34,19.71 16.1,20.47 v18.01,20.47
  Bottom 0.152: U1.4 11.3,19.69 11.81,19.69 11.83,19.71 v14.2,19.71 | U2.31 21.97,23.52 21.97,22.79 20.93,21.75 20.93,21.2 20.33,20.6 18.14,20.6 v18.01,20.47
LB_AD6
  Bottom 0.152: U1.2 13.53,20.48 13.78,20.72 14.62,20.72 14.86,20.48 17.08,20.48 17.74,21.13 18.28,21.13 18.45,20.96 20.19,20.96 20.57,21.34 20.57,21.89 21.58,22.9 U2.32
LB_AD7
  Bottom 0.152: U1.1 13.43,20.88 13.63,21.08 14.77,21.08 14.97,20.88 16.98,20.88 17.59,21.49 19,21.49 19.26,21.75 19.26,21.89 20.58,23.21 U2.34
LB_AD8  (via drill 0.35)
  Top 0.152: v13.69,21.74 15.47,23.52 v16.87,23.52
  Bottom 0.152: U2.37 18.81,24.33 18.51,24.03 17.94,24.03 17.43,23.52 v16.87,23.52 | 10.55,21.62 U1.68 13.57,21.62 v13.69,21.74
LB_AD9
  Bottom 0.152: U1.67 10.15,22.15 10.51,22.51 14.64,22.51 14.74,22.6 15.28,22.6 15.53,22.36 18.81,22.36 19.21,22.76 19.6,22.76 20.08,23.23 U2.35
LB_AD10
  Bottom 0.152: 9.75,21.64 U1.66 9.74,22.49 10.11,22.86 14.5,22.86 14.59,22.96 15.43,22.96 15.68,22.71 18.66,22.71 U2.36
LB_AD11  (via drill 0.35)
  Top 0.152: v11.51,23.88 12.67,25.05 12.67,25.81 14.58,27.71 v14.96,27.71
  Bottom 0.152: 11.15,23.56 v11.51,23.88 11.12,23.5 9.86,23.5 9.38,23.02 9.38,22.26 9.34,22.21 U1.65 | U2.43 18.42,27.33 18.15,27.05 15.62,27.05 v14.96,27.71
LB_AD12
  Bottom 0.152: U1.64 8.95,22.33 9.03,22.41 9.03,23.17 9.71,23.85 10.47,23.85 11.16,24.54 11.78,24.54 12.03,24.28 17.69,24.28 18.13,24.72 18.77,24.72 U2.38
LB_AD13
  Bottom 0.152: U1.63 8.55,22.43 8.67,22.55 8.67,23.32 9.57,24.21 10.33,24.21 11.3,25.18 12.46,25.18 13.98,26.7 18.3,26.7 18.42,26.83 U2.42
LB_AD14
  Bottom 0.152: U1.62 8.15,22.53 8.32,22.7 8.32,23.46 9.42,24.56 10.18,24.56 11.16,25.54 12.31,25.54 13.69,26.91 13.69,27.46 15.05,28.83 15.23,28.83 15.3,28.76 16.14,28.76 16.21,28.83 17.01,28.83 17.08,28.76 17.92,28.76 17.99,28.83 U2.46
LB_AD15
  Bottom 0.152: U1.61 7.75,21.64 7.75,22.64 7.96,22.85 7.96,23.61 9.27,24.92 10.03,24.92 11.01,25.89 12.17,25.89 13.33,27.06 13.33,27.61 14.94,29.22 15.35,29.22 15.45,29.11 15.99,29.11 16.1,29.22 17.12,29.22 17.23,29.11 17.77,29.11 17.88,29.22 18.77,29.22 U2.47
LB_ALE  (via drill 0.35)
  Top 0.152: v17.75,28.09 16.1,26.44 16.1,25.13 15.51,24.54 14.99,24.54 11.31,20.86 10,20.86 9.84,20.7 9.84,20.08 9.58,19.82 8.43,19.82 7.85,19.24 7.85,18.12 7.46,17.73 6.89,17.73 6.51,17.36 4.27,17.36 3.89,16.98 3.89,16.54 v2.01,16.54
  Bottom 0.152: U2.45 17.99,28.33 v17.75,28.09 | U1.40 2.06,16.48 v2.01,16.54
LB_CLK  (via drill 0.35)
  Top 0.152: v16.1,27.97 15.7,28.37 14.48,28.37 12.82,26.72 12.82,26.65 12.44,26.27 11.61,26.27 8.69,23.35 8.69,22.93 8.3,22.54 7.88,22.54 7.09,21.74 6.37,21.74 6.33,21.78 5.2,21.78 5.16,21.74 v3.15,21.74
  Bottom 0.152: U1.51 3.15,21.13 v3.15,21.74 | U2.44 18.42,27.83 18.03,27.44 16.63,27.44 v16.1,27.97
LB_CS  (via drill 0.35)
  Top 0.152: v2.01,17.5 3.91,17.5 4.13,17.72 5.45,17.72 7.54,19.81 7.54,20.52 8.49,21.47 8.93,21.47 9.72,22.26 12.21,22.26 14.85,24.9 15.36,24.9 15.74,25.28 15.74,26.68 16.76,27.7 16.76,29.51 16.84,29.59 16.84,30.04 17.23,30.43 17.77,30.43 17.82,30.38 v18.39,30.38
  Bottom 0.152: U1.42 2.22,17.28 v2.01,17.5 | v18.39,30.38 18.39,30.31 U2.48
LB_DACK  (via drill 0.35)
  Top 0.152: R2.1 v1.85,18.7 | R2.1 v1.84,18.7 | v15.09,25.55 15,25.55 14.34,24.9 13.96,24.9 11.93,22.86 9.82,22.86 8.79,21.83 8.18,21.83 7.38,21.03 6.07,21.03 6.04,21.07 5.49,21.07 5.08,20.66 5.08,19.13 4.03,18.07 3.98,18.07 3.87,17.97 2.93,17.97 2.2,18.7 R2.1
  Bottom 0.152: U1.45 3.38,18.49 2.77,18.49 2.56,18.7 v1.85,18.7 | v15.09,25.55 16.7,25.55 16.97,25.28 17.52,25.28 17.96,25.72 18.77,25.72 U2.40
LB_DREQ  (via drill 0.35)
  Top 0.152: R3.1 v1.85,20.22 v1.84,20.22 2.57,20.95 3.74,20.95 4.1,21.31 5.23,21.31 5.35,21.42 6.19,21.42 6.22,21.39 7.23,21.39 8.03,22.18 8.64,22.18 9.67,23.22 11.78,23.22 14.06,25.5 14.07,25.5 | 14.07,25.45 14.07,25.5 | 14.07,25.5 v14.07,25.55
  Bottom 0.152: U1.46 3.38,18.89 2.87,18.89 2.71,19.05 2.71,19.57 2.06,20.22 v1.85,20.22 | U2.39 18.07,25.33 17.64,24.9 14.73,24.9 v14.07,25.55
LB_IRQ  (via drill 0.35)
  Top 0.152: R1.1 4.9,14.91 v4.93,14.89 6.24,16.2 7.89,16.2 9.73,18.04 10.74,18.04 11.46,18.75 11.46,20.5 15.14,24.18 15.65,24.18 16.46,24.99 16.46,25.02 17.25,25.81 v17.25,25.93
  Bottom 0.152: U1.32 4.94,14.87 v4.93,14.89 | U2.41 17.64,26.33 v17.25,25.93
LB_RD  (via drill 0.35)
  VCC 0.152: v18.9,32.28 18.13,31.52 14.96,31.52 10.77,27.33 10.39,27.33 9.25,26.19 9.25,22.38 7.92,21.06 7.34,21.06 6.04,19.75 5.66,19.75 2.86,16.96 2.86,15.99 v2.01,15.14
  Bottom 0.152: U1.38 2.55,15.68 v2.01,15.14 | U2.2 20.08,30.98 18.9,32.16 v18.9,32.28
LB_RDY  (via drill 0.35)
  VCC 0.152: v19.91,32.92 19.55,32.56 19.55,32.01 18.68,31.14 15.34,31.14 9.63,25.43 9.63,15.85 7.9,14.12 5.9,14.12 4.75,12.97 4.75,12.93 v4.29,12.47
  Bottom 0.152: U1.33 4.53,13.72 4.53,13.21 4.29,12.97 v4.29,12.47 | U2.3 20.58,31.24 19.91,31.9 v19.91,32.92
LB_WR  (via drill 0.35)
  GND 0.152: v21,31.78 20.33,31.11 14.54,31.11 2.74,19.3 2.74,13.92 2.77,13.88 v2.77,12.85
  Bottom 0.152: v2.77,12.85 3.26,12.85 U1.34 | U2.4 21.06,30.55 21.06,31.72 v21,31.78
LED_0  (via drill 0.35)
  Top 0.152: R16.2 3.91,38.94 5.41,40.44 v6.48,40.44
  Bottom 0.152: v6.48,40.44 5.72,39.68 U3.15
LED_1  (via drill 0.35)
  Top 0.152: R17.2 5.47,39.06 5.47,39.12 5.63,39.28 6.27,39.28 6.63,39.63 v7.44,40.44
  Bottom 0.152: v7.44,40.44 7.08,40.08 7.05,40.08 6.22,39.25 U3.16
LED_2  (via drill 0.35)
  Top 0.152: R18.2 6.61,39.06 6.61,39.12 6.77,39.28 7.21,39.28 8.01,40.09 v8.4,40.09
  Bottom 0.152: v8.4,40.09 8.04,39.73 7.2,39.73 6.72,39.25 U3.17
LED_3  (via drill 0.35)
  Top 0.152: v11.91,36.53 11.61,36.83 11.61,36.87 9.83,38.65 R19.2
  Bottom 0.152: U3.29 10.99,36.17 11.45,36.17 11.81,36.53 v11.91,36.53
N$1  (via drill 0.35)
  Top 0.152: v6.12,14.84 6.12,14.19 5.29,13.36 4.25,13.36 3.63,12.75 3.63,11.7 R4.1
  Bottom 0.152: U1.29 6.13,14.26 6.12,14.27 v6.12,14.84
N$2  (via drill 0.35)
  Top 0.152: R10.1 v3.91,24.66
  Bottom 0.152: v3.91,24.66 4.72,23.86 4.4,23.54 4.4,23 4.7,22.69 4.7,22.38 4.94,22.14 U1.54
N$3  (via drill 0.35)
  Top 0.152: R11.1 v5.44,24.66
  Bottom 0.152: U1.56 5.74,24.36 v5.44,24.66
N$4  (via drill 0.35)
  Top 0.152: R12.1 v6.96,24.66
  Bottom 0.152: U1.58 6.54,24.25 v6.96,24.66
N$5  (via drill 0.35)
  Top 0.152: v6.83,30.48 5.77,30.48 4.7,29.41 2.92,29.41 2.77,29.57 2.77,30.68 2.74,30.7 1.42,30.7 1.25,30.87 1.25,31.8 1.42,31.96 1.57,31.96 R14.2
  Bottom 0.152: U3.44 6.72,30.6 v6.83,30.48
N$6  (via drill 0.35)
  Top 0.152: v11.1,39.73 12.17,38.66 12.17,37.2 12.57,36.8 12.57,36.25 12.19,35.87 11.64,35.87 11.26,36.25 11.26,36.73 10.48,37.51 C26.1
  Bottom 0.152: v11.1,39.73 10.93,39.73 10.73,39.53 10.33,39.53 10.28,39.48 9.47,39.48 9.3,39.31 9.3,38.85 U3.22
N$7  (via drill 0.35)
  Top 0.152: R13.1 11.99,13.24 v11.46,12.7
  Bottom 0.152: v11.46,12.7 11.29,12.87 U1.17
N$8  (via drill 0.35)
  Top 0.254: v26.77,36.58 26.77,35.01 27.1,34.69 27.1,33.44 D1.C
  VCC 0.254: v26.03,22.3 26.39,22.66 26.68,22.66 27.1,23.08 27.1,23.66 26.75,24.02 26.75,30.11 26.34,30.52 26.34,31.1 26.76,31.52 27.07,31.52 27.1,31.55 27.45,31.9 27.45,35.9 v26.77,36.58
  Bottom 0.152: v26.03,22.3 26.03,22.79 25.73,23.1 25.73,23.64 25.78,23.69 U2.24
N$10
  Top 0.152: LED0.A R16.1
N$11
  Top 0.152: R17.1 LED1.A
N$12
  Top 0.152: R18.1 LED2.A
N$13
  Top 0.152: R19.1 LED3.A
PCIE_CLK_N
  Top 0.152: C6.1 7.42,6.41 7.42,2.95 7.2,2.73 U$1.11
PCIE_CLK_P
  Top 0.152: C5.1 7.77,6.41 7.77,2.95 8,2.72 U$1.13
PCIE_CLKREQN  (via drill 0.35)
  Top 0.152: U$1.7 5.6,9.12 6.42,9.94 6.42,10.87 v7.54,11.99
  Bottom 0.152: v7.54,11.99 8.54,12.99 U1.23
PCIE_DI_N
  Top 0.152: C1.1 15.42,6.41 15.42,2.95 15.2,2.73 U$1.23
PCIE_DI_P
  Top 0.152: C2.1 15.77,6.41 15.77,2.95 16,2.72 U$1.25
PCIE_DO_N
  Top 0.152: C3.2 18.59,6.41 18.59,3.07 18.4,2.88 U$1.31
PCIE_DO_P
  Top 0.152: C4.2 18.95,6.41 18.95,3.07 19.2,2.82 U$1.33
PCIE_PERSTN  (via drill 0.35)
  GND 0.152: v2.57,35.39 4.41,37.24 19.47,37.24 19.67,37.04 20.21,37.04 20.41,37.24 24.97,37.24 25.32,37.59 v26.03,37.59
  Bottom 0.152: U4.3 23.47,12.27 23.37,12.17 | 23.37,12.17 22.83,12.7 22.83,16.61 24.97,18.75 24.97,19.1 28.17,22.3 28.17,23.01 28.88,23.72 28.88,36.17 27.81,37.24 27.1,37.24 26.75,37.59 v26.03,37.59 | U3.7 3.95,35.5 3.49,35.5 3.38,35.39 v2.57,35.39 | U$1.22 14.8,3.09 15.31,3.6 15.31,4.11 23.37,12.17
PCIE_WAKEN  (via drill 0.35)
  Top 0.152: U$1.1 3.2,5.16 3.63,5.59 3.63,7.37 v4.7,8.43
  Bottom 0.152: U1.21 9.34,12.86 6.04,9.55 5.82,9.55 v4.7,8.43
SD_PIN1_DAT2
  Bottom 0.152: U2.11 24.58,39.32 24.89,39.63 24.89,44.45 21.56,47.78 19.91,47.78 SD_IFACE.8
SD_PIN2_DAT3_CD_CS  (via drill 0.35)
  Top 0.152: v26.01,42.57 23.34,45.24 19.91,45.24 SD_IFACE.6
  Bottom 0.152: U2.12 25.08,38.59 26.01,39.52 v26.01,42.57
SD_PIN3_CMD_DI  (via drill 0.35)
  Top 0.152: SD_IFACE.4 19.91,42.7 19.91,40.67 22.27,38.3 26.39,38.3 27.51,37.18 27.51,33.85 28.91,32.45 28.91,30.2 28.68,29.97 28.68,25.17 28.25,24.74 v27.9,24.74
  Bottom 0.152: U2.21 26.94,25.83 27.9,24.87 v27.9,24.74
SD_PIN4_VDD  (via drill 0.35)
  Top 0.152: v25.81,36.42 25.4,36.48 23.34,36.48 18.64,41.17 SD_IFACE.2
  Bottom 0.152: v25.81,36.42 25.78,35.81 25.78,34.71 25.73,34.67 25.73,34.12 25.78,34.08 U2.13
SD_PIN5_CLK  (via drill 0.35)
  Top 0.152: v16.48,44.1 16.48,47.14 17.12,47.78 19.91,47.78 SD_IFACE.7
  Bottom 0.152: v16.48,44.1 16.48,42.12 18.21,40.39 18.29,40.39 21.63,37.04 21.63,33.03 22.08,32.58 U2.6
SD_PIN7_DAT0_DO
  Bottom 0.152: U2.9 23.58,41.58 SD_IFACE.3
SD_PIN8_DAT1  (via drill 0.35)
  Top 0.152: v24.23,39.91 22.71,41.43 SD_IFACE.1
  Bottom 0.152: U2.10 24.08,39.75 v24.23,39.91
STM_IRQ  (via drill 0.35)
  Top 0.152: v9.68,28.35 9.81,28.35 10.47,27.69 12.86,27.69 15.06,29.89 15.06,30.04 16.06,31.04 20.14,31.04 25.32,25.86 v27.84,25.86
  Bottom 0.152: U2.18 26.34,27.33 26.8,26.87 26.8,26.65 27.59,25.86 v27.84,25.86 | U3.42 7.72,30.31 v9.68,28.35
STM_SWCLK  (via drill 0.35)
  Top 0.152: v13.93,31.92 13.55,31.55 11.6,31.55 8.76,28.7 8.47,28.7 8.12,28.35 3.63,28.35 2.21,26.93 2.21,26.57 v1.85,26.21
  Bottom 0.152: U3.37 12.53,31.9 12.88,31.55 13.55,31.55 v13.93,31.92 | U$1.12 7.54,1.41 7.54,4.17 1.14,10.57 1.14,25.5 v1.85,26.21
STM_SWDIO  (via drill 0.35)
  Top 0.152: v13.23,33.68 12.82,33.27 12.61,33.27 8.39,29.06 v7.9,29.06
  GND 0.152: v6.48,4.52 5.77,5.23 5.77,9.28 6.78,10.3 6.78,15.11 5.77,16.12 v5.77,20.41
  VCC 0.152: v7.9,29.06 7.9,22.3 6.01,20.41 v5.77,20.41
  Bottom 0.152: v13.23,33.68 13.13,33.58 U3.34 | v6.48,4.52 6.8,4.2 6.8,4.06 7.13,3.73 7.13,3.18 6.8,2.85 U$1.10
STM_UART_RX  (via drill 0.35)
  Top 0.152: U$1.17 12.8,5.31 12.52,5.59 12.52,12.16 13.03,12.67 13.03,13.8 12.52,14.31 12.52,19.46 v15.01,21.95 | v16.79,35.82 16.79,33.33 16.13,32.67 v14.83,32.67
  GND 0.152: v15.01,21.95 12.17,24.79 v12.17,26.93
  Bottom 0.152: U3.31 16.06,35.08 v16.79,35.82 | v14.83,32.67 14.83,30.3 12.17,27.64 v12.17,26.93
STM_UART_TX  (via drill 0.35)
  Top 0.152: U$1.19 13.6,4.18 v13.94,4.52 | v15.72,36.17 v15.72,33.33
  GND 0.152: v15.72,29.77 15.72,29.28 16.76,28.24 16.76,27.7 15.74,26.68 15.74,13.08 13.94,11.28 v13.94,4.52
  Bottom 0.152: 10.99,35.5 U3.30 15.13,35.58 v15.72,36.17 | v15.72,33.33 v15.72,29.77
USART_CK  (via drill 0.35)
  Top 0.152: v7.19,41.5 8.25,42.57 9.68,42.57 10.03,42.93 10.03,45.26 USART.5
  Bottom 0.152: v7.19,41.5 6.78,41.1 6.2,41.1 5.82,40.71 5.82,40.28 5.22,39.68 U3.14
USART_CTS
  Bottom 0.152: USART.8 7.72,49.05 6.96,48.29 6.96,46.38 2.01,41.43 2.01,38 2.92,37.08 U3.10
USART_RTS
  Bottom 0.152: USART.6 8.61,46.51 2.41,40.31 2.41,38.23 2.98,37.67 3.95,37.67 U3.11
USART_RX
  Bottom 0.152: U3.13 4.8,38.85 4.8,39.31 4.86,39.37 4.86,39.83 5.46,40.43 5.46,40.86 6.06,41.45 6.2,41.45 6.92,42.16 7.65,42.16 8.06,42.57 9.88,42.57 USART.3
USART_TX
  Bottom 0.152: U3.12 3.63,38.48 3.63,39.73 7.87,43.97 USART.4
USB_D+  (via drill 0.35)
  VCC 0.152: v21.06,6.3 23.55,8.79 23.55,10.57 23.19,10.92 22.12,10.92 21.77,11.28 21.77,11.63 22.12,11.99 23.19,11.99 23.55,12.35 23.55,21.95 24.97,23.37 24.97,29.81 24.87,29.91 24.87,31.71 24.97,31.81 24.97,34.39 23.19,36.17 22.12,36.17 20.88,34.93 v19.81,34.93
  Bottom 0.152: v19.81,34.93 19.22,34.34 12.96,34.34 12.7,34.08 U3.33 | v21.06,6.3 21.06,1.49 U$1.38
USB_D-  (via drill 0.35)
  VCC 0.152: v19.1,35.64 20.7,37.24 23.19,37.24 25.68,34.75 25.68,32.02 25.22,31.57 25.22,30.05 25.63,29.65 25.63,23.55 25.68,23.5 25.68,23.37 24.26,21.95 24.26,8.08 v20.34,4.17
  Bottom 0.152: U3.32 12.7,34.58 12.81,34.7 18.16,34.7 v19.1,35.64 | v20.34,4.17 20.34,1.4 U$1.36
VCCIO_0  (via drill 0.35)
  Top 0.457: C15.1 22.9,24.21 R7.2 21.27,22.98 v19.91,21.62 | C15.1 C14.1 | C15.1 C13.1
  Bottom 0.152: U2.33 21.08,22.9 20.21,22.04 20.21,21.92 v19.91,21.62
VCCIO_1  (via drill 0.35)
  Top 0.508: R8.2 C16.1 C17.1 C18.1 26.88,21.37 27.81,22.3 v27.81,23.72
  Bottom 0.152: U2.22 26.21,25.33 v27.81,23.72
VCCIO_2  (via drill 0.35)
  Top 0.457: R9.2 C19.1 C21.1 C20.1 18.5,29.57 18.05,29.57 17.85,29.77 v17.5,29.77
  Bottom 0.152: U2.1 19.17,30.53 18.66,31.04 17.7,31.04 17.14,30.48 17.14,30.13 v17.5,29.77